# EAGLE design DMXDebugger (EAGLE 6.5.0)

## Sheet 1 of 2
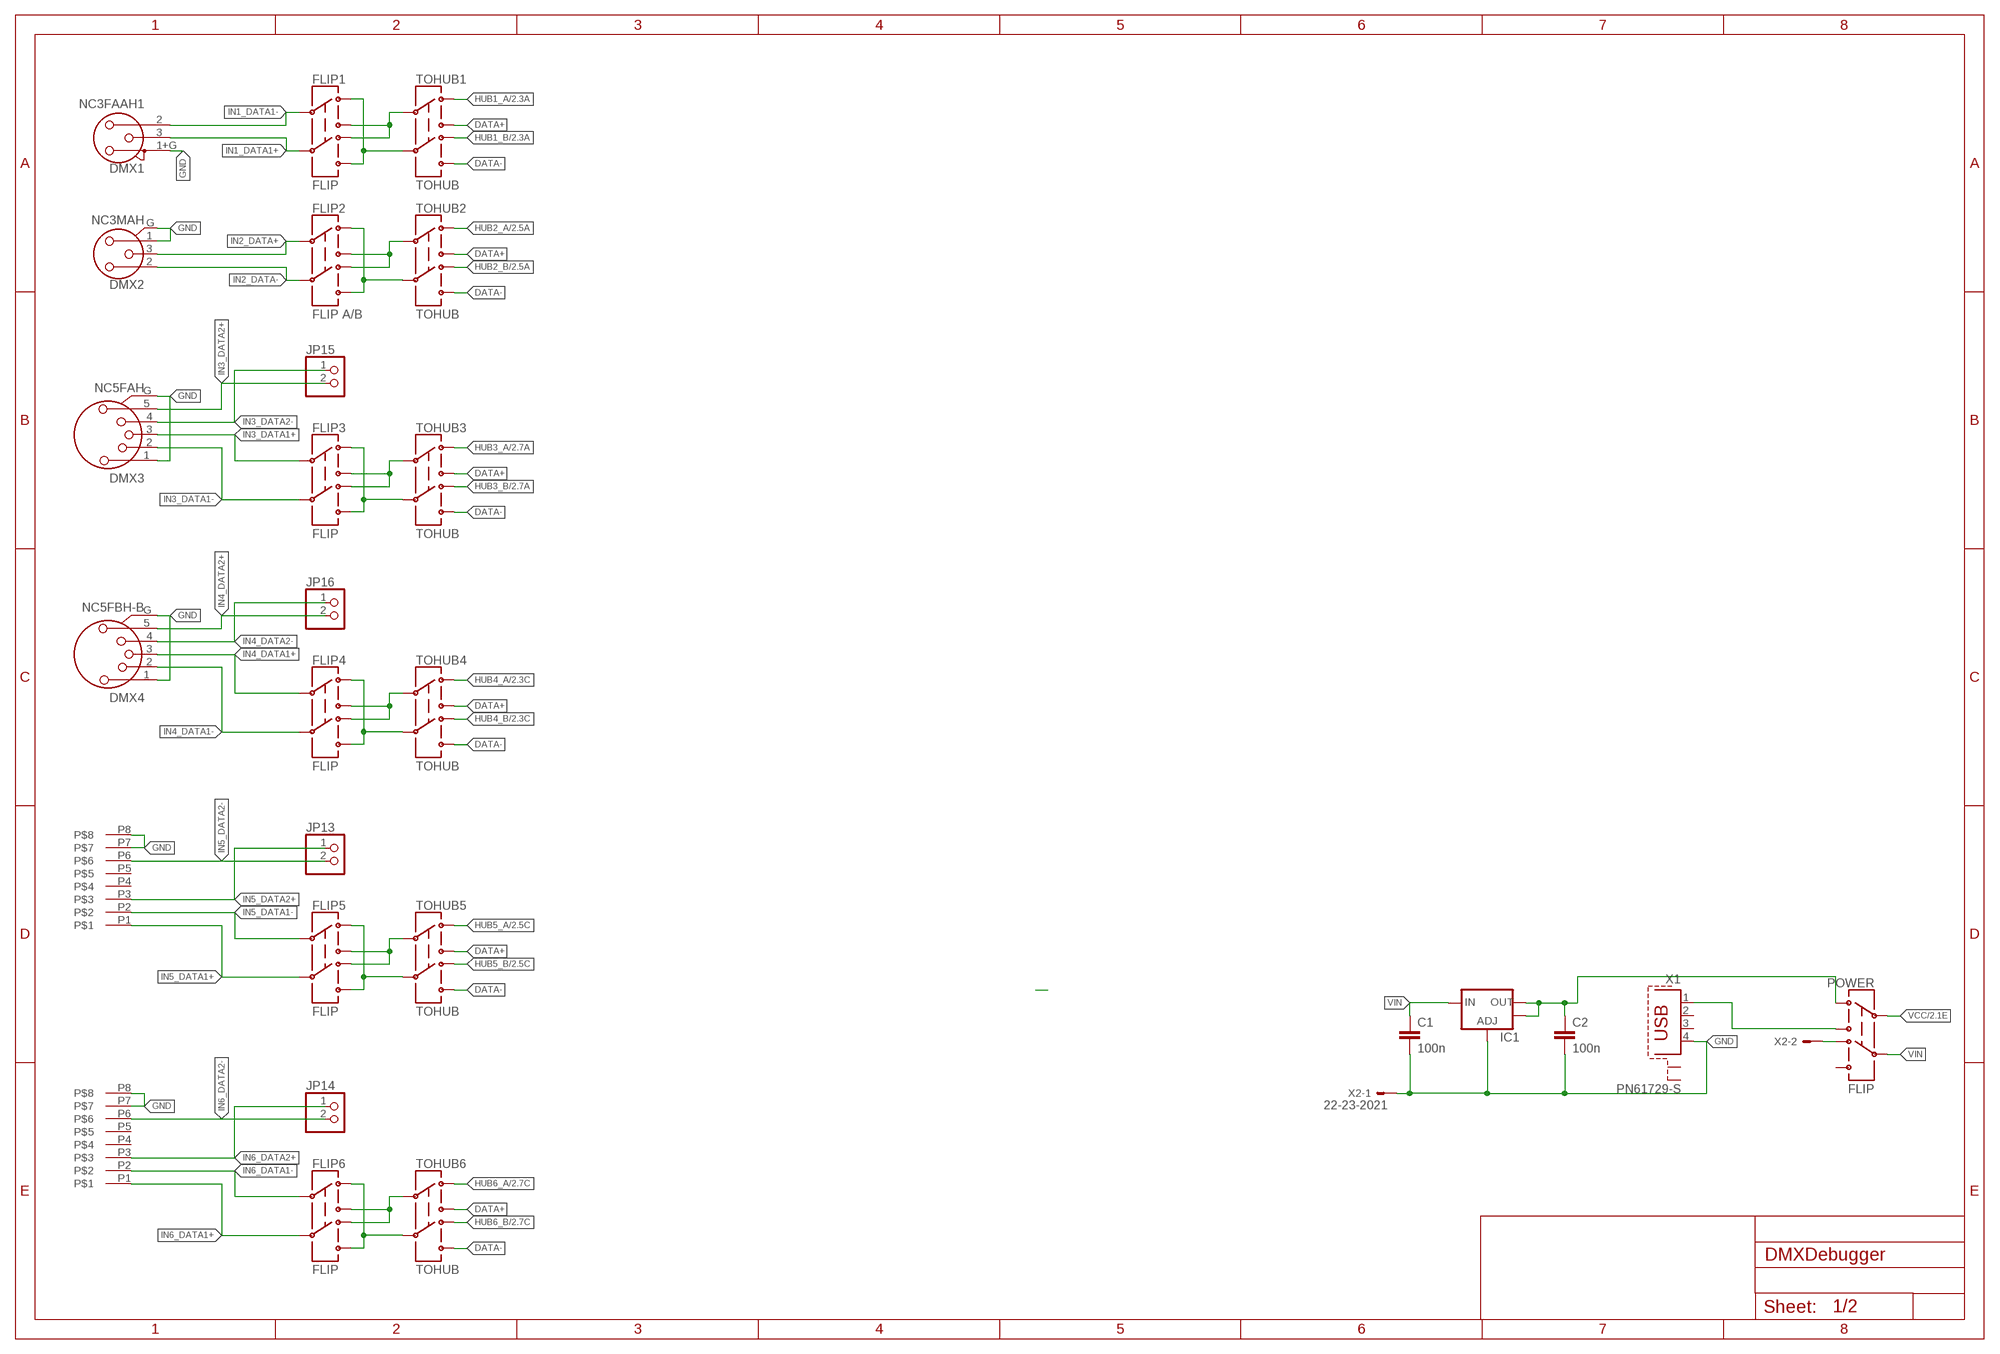
[diagram p0: schematic, sheet 1]

### Parts
C1  100n  C-EUC1206  [C1206]
C2  100n  C-EUC1206  [C1206]
DMX1  NC3FAAH1  MC3FAH1  [NC3FAH1]
DMX2  NC3MAH  NC3FAH2  [NC3FAH2]
DMX3  NC5FAH  [NC5FAH]
DMX4  NC5FBH-B  [NC5FBH-B]
DMX5  RJHS508  [P-RJHS-538X]
DMX6  RJHS508  [P-RJHS-538X]
FLIP1  FLIP  SWITCH-DPDT  [MSS-2235]
FLIP2  FLIP A/B  SWITCH-DPDT  [MSS-2235]
FLIP3  FLIP  SWITCH-DPDT  [MSS-2235]
FLIP4  FLIP  SWITCH-DPDT  [MSS-2235]
FLIP5  FLIP  SWITCH-DPDT  [MSS-2235]
FLIP6  FLIP  SWITCH-DPDT  [MSS-2235]
IC1  V_REG_LM1117SOT223  [SOT223]
JP13  PINHD-1X2  [1X02]
JP14  PINHD-1X2  [1X02]
JP15  PINHD-1X2  [1X02]
JP16  PINHD-1X2  [1X02]
POWER  FLIP  SWITCH-DPDT  [MSS-2235]
TOHUB1  TOHUB  SWITCH-DPDT  [MSS-2235]
TOHUB2  TOHUB  SWITCH-DPDT  [MSS-2235]
TOHUB3  TOHUB  SWITCH-DPDT  [MSS-2235]
TOHUB4  TOHUB  SWITCH-DPDT  [MSS-2235]
TOHUB5  TOHUB  SWITCH-DPDT  [MSS-2235]
TOHUB6  TOHUB  SWITCH-DPDT  [MSS-2235]
X1  PN61729-S  [PN61729-S]
X2  22-23-2021  [22-23-2021]

### Nets
DATA+: TOHUB1.3 TOHUB2.3 TOHUB3.3 TOHUB4.3 TOHUB5.3 TOHUB6.3
DATA-: TOHUB1.4 TOHUB2.4 TOHUB3.4 TOHUB4.4 TOHUB5.4 TOHUB6.4
GND: C1.2 C2.2 DMX1.1+G DMX2.1 DMX2.G DMX3.1 DMX3.G DMX4.1 DMX4.G DMX5.P7 DMX5.P8 DMX6.P7 DMX6.P8 IC1.1(ADJ) X1.4 X2.1 ; also sheet 2
HUB1_A: TOHUB1.1 ; also sheet 2
HUB1_B: TOHUB1.6 ; also sheet 2
HUB2_A: TOHUB2.1 ; also sheet 2
HUB2_B: TOHUB2.6 ; also sheet 2
HUB3_A: TOHUB3.1 ; also sheet 2
HUB3_B: TOHUB3.6 ; also sheet 2
HUB4_A: TOHUB4.1 ; also sheet 2
HUB4_B: TOHUB4.6 ; also sheet 2
HUB5_A: TOHUB5.1 ; also sheet 2
HUB5_B: TOHUB5.6 ; also sheet 2
HUB6_A: TOHUB6.1 ; also sheet 2
HUB6_B: TOHUB6.6 ; also sheet 2
IN1_DATA1+: DMX1.3 FLIP1.5
IN1_DATA1-: DMX1.2 FLIP1.2
IN2_DATA+: DMX2.3 FLIP2.2
IN2_DATA-: DMX2.2 FLIP2.5
IN3_DATA1+: DMX3.3 FLIP3.2
IN3_DATA1-: DMX3.2 FLIP3.5
IN3_DATA2+: DMX3.5 JP15.2
IN3_DATA2-: DMX3.4 JP15.1
IN4_DATA1+: DMX4.3 FLIP4.2
IN4_DATA1-: DMX4.2 FLIP4.5
IN4_DATA2+: DMX4.5 JP16.2
IN4_DATA2-: DMX4.4 JP16.1
IN5_DATA1+: DMX5.P1 FLIP5.5
IN5_DATA1-: DMX5.P2 FLIP5.2
IN5_DATA2+: DMX5.P3 JP13.1
IN5_DATA2-: DMX5.P6 JP13.2
IN6_DATA1+: DMX6.P1 FLIP6.5
IN6_DATA1-: DMX6.P2 FLIP6.2
IN6_DATA2+: DMX6.P3 JP14.1
IN6_DATA2-: DMX6.P6 JP14.2
N$1: POWER.6 X2.2
N$5: POWER.3 X1.1
N$77: FLIP1.3 FLIP1.6 TOHUB1.2
N$78: FLIP1.1 FLIP1.4 TOHUB1.5
N$79: FLIP2.1 FLIP2.4 TOHUB2.5
N$80: FLIP2.3 FLIP2.6 TOHUB2.2
N$81: FLIP3.1 FLIP3.4 TOHUB3.5
N$82: FLIP4.1 FLIP4.4 TOHUB4.5
N$83: FLIP5.1 FLIP5.4 TOHUB5.5
N$84: FLIP3.3 FLIP3.6 TOHUB3.2
N$85: FLIP4.3 FLIP4.6 TOHUB4.2
N$86: FLIP5.3 FLIP5.6 TOHUB5.2
N$87: FLIP6.1 FLIP6.4 TOHUB6.5
N$88: FLIP6.3 FLIP6.6 TOHUB6.2
VCC [Vcc]: POWER.2 ; also sheet 2
VIN: C1.1 IC1.3(IN) POWER.5
VOUT: C2.1 IC1.2(OUT) IC1.4(OUT) POWER.1
Unconnected: DMX5.P4 DMX5.P5 DMX6.P4 DMX6.P5 POWER.4 X1.2 X1.3 X1.S1 X1.S2

## Sheet 2 of 2
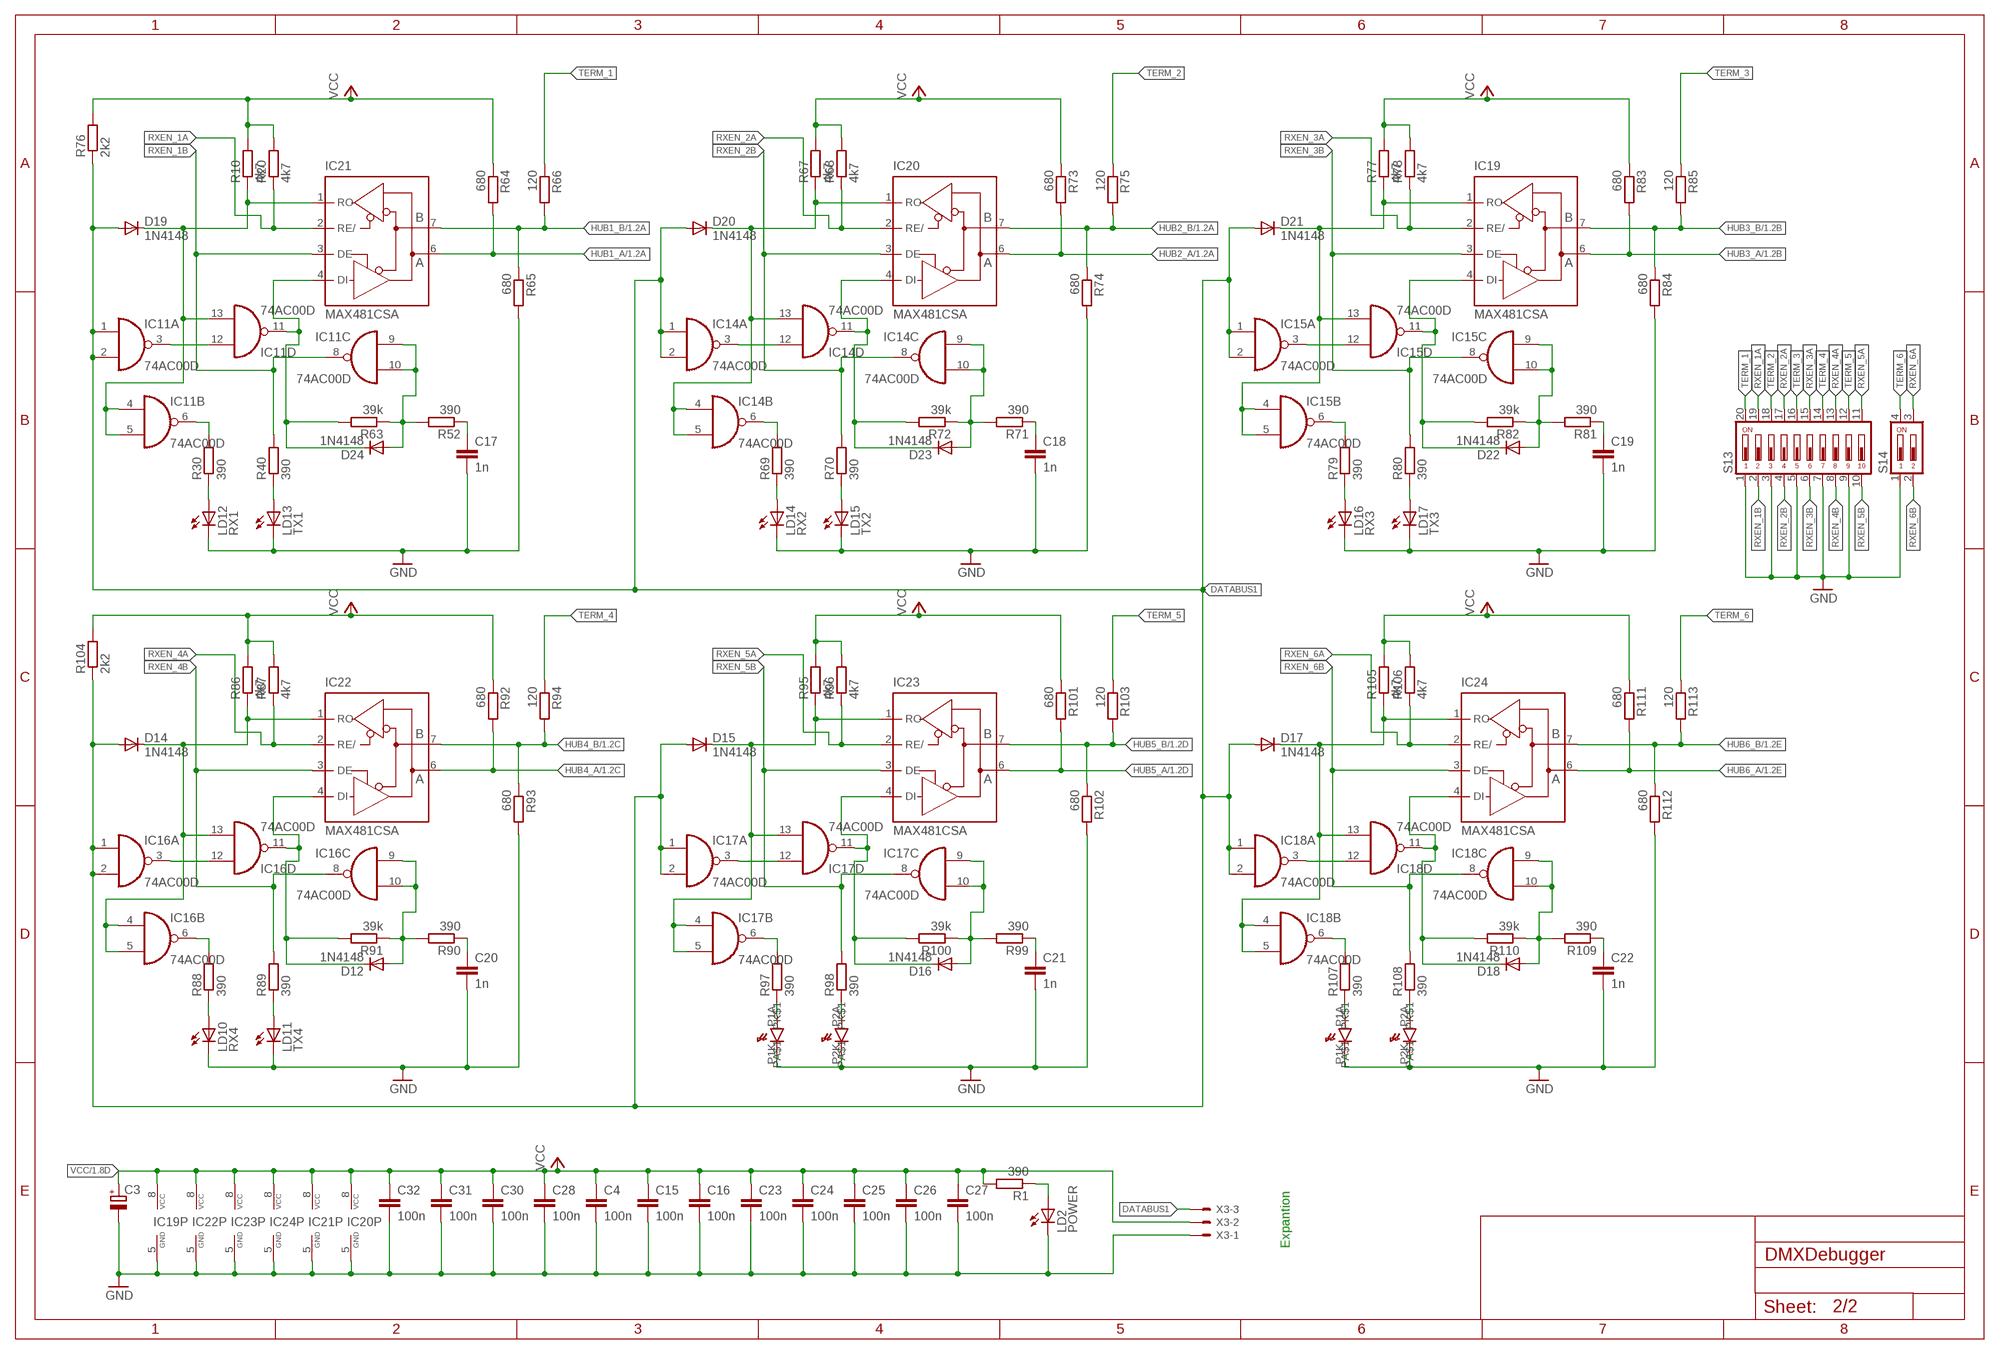
[diagram p1: schematic, sheet 2]

### Parts
C3  CPOL-EUD  [PANASONIC_D]
C4  100n  C-EUC1206  [C1206]
C15  100n  C-EUC1206  [C1206]
C16  100n  C-EUC1206  [C1206]
C17  1n  C-EUC1206  [C1206]
C18  1n  C-EUC1206  [C1206]
C19  1n  C-EUC1206  [C1206]
C20  1n  C-EUC1206  [C1206]
C21  1n  C-EUC1206  [C1206]
C22  1n  C-EUC1206  [C1206]
C23  100n  C-EUC1206  [C1206]
C24  100n  C-EUC1206  [C1206]
C25  100n  C-EUC1206  [C1206]
C26  100n  C-EUC1206  [C1206]
C27  100n  C-EUC1206  [C1206]
C28  100n  C-EUC1206  [C1206]
C30  100n  C-EUC1206  [C1206]
C31  100n  C-EUC1206  [C1206]
C32  100n  C-EUC1206  [C1206]
D12  1N4148  DIODE-MINIMELF  [MINIMELF]
D14  1N4148  DIODE-MINIMELF  [MINIMELF]
D15  1N4148  DIODE-MINIMELF  [MINIMELF]
D16  1N4148  DIODE-MINIMELF  [MINIMELF]
D17  1N4148  DIODE-MINIMELF  [MINIMELF]
D18  1N4148  DIODE-MINIMELF  [MINIMELF]
D19  1N4148  DIODE-MINIMELF  [MINIMELF]
D20  1N4148  DIODE-MINIMELF  [MINIMELF]
D21  1N4148  DIODE-MINIMELF  [MINIMELF]
D22  1N4148  DIODE-MINIMELF  [MINIMELF]
D23  1N4148  DIODE-MINIMELF  [MINIMELF]
D24  1N4148  DIODE-MINIMELF  [MINIMELF]
IC11  74AC00D  [SO14]
IC14  74AC00D  [SO14]
IC15  74AC00D  [SO14]
IC16  74AC00D  [SO14]
IC17  74AC00D  [SO14]
IC18  74AC00D  [SO14]
IC19  MAX481CSA  [SO08]
IC20  MAX481CSA  [SO08]
IC21  MAX481CSA  [SO08]
IC22  MAX481CSA  [SO08]
IC23  MAX481CSA  [SO08]
IC24  MAX481CSA  [SO08]
LD2  POWER  LEDCHIP-LED0603  [CHIP-LED0603]
LD10  RX4  LEDCHIP-LED0603  [CHIP-LED0603]
LD11  TX4  LEDCHIP-LED0603  [CHIP-LED0603]
LD12  RX1  LEDCHIP-LED0603  [CHIP-LED0603]
LD13  TX1  LEDCHIP-LED0603  [CHIP-LED0603]
LD14  RX2  LEDCHIP-LED0603  [CHIP-LED0603]
LD15  TX2  LEDCHIP-LED0603  [CHIP-LED0603]
LD16  RX3  LEDCHIP-LED0603  [CHIP-LED0603]
LD17  TX3  LEDCHIP-LED0603  [CHIP-LED0603]
R1  390  R-EU_R1206  [R1206]
R10  4k7  R-EU_R1206  [R1206]
R20  4k7  R-EU_R1206  [R1206]
R30  390  R-EU_R1206  [R1206]
R40  390  R-EU_R1206  [R1206]
R52  390  R-EU_R1206  [R1206]
R63  39k  R-EU_R1206  [R1206]
R64  680  R-EU_R1206  [R1206]
R65  680  R-EU_R1206  [R1206]
R66  120  R-EU_R1206  [R1206]
R67  4k7  R-EU_R1206  [R1206]
R68  4k7  R-EU_R1206  [R1206]
R69  390  R-EU_R1206  [R1206]
R70  390  R-EU_R1206  [R1206]
R71  390  R-EU_R1206  [R1206]
R72  39k  R-EU_R1206  [R1206]
R73  680  R-EU_R1206  [R1206]
R74  680  R-EU_R1206  [R1206]
R75  120  R-EU_R1206  [R1206]
R76  2k2  R-EU_R1206  [R1206]
R77  4k7  R-EU_R1206  [R1206]
R78  4k7  R-EU_R1206  [R1206]
R79  390  R-EU_R1206  [R1206]
R80  390  R-EU_R1206  [R1206]
R81  390  R-EU_R1206  [R1206]
R82  39k  R-EU_R1206  [R1206]
R83  680  R-EU_R1206  [R1206]
R84  680  R-EU_R1206  [R1206]
R85  120  R-EU_R1206  [R1206]
R86  4k7  R-EU_R1206  [R1206]
R87  4k7  R-EU_R1206  [R1206]
R88  390  R-EU_R1206  [R1206]
R89  390  R-EU_R1206  [R1206]
R90  390  R-EU_R1206  [R1206]
R91  39k  R-EU_R1206  [R1206]
R92  680  R-EU_R1206  [R1206]
R93  680  R-EU_R1206  [R1206]
R94  120  R-EU_R1206  [R1206]
R95  4k7  R-EU_R1206  [R1206]
R96  4k7  R-EU_R1206  [R1206]
R97  390  R-EU_R1206  [R1206]
R98  390  R-EU_R1206  [R1206]
R99  390  R-EU_R1206  [R1206]
R100  39k  R-EU_R1206  [R1206]
R101  680  R-EU_R1206  [R1206]
R102  680  R-EU_R1206  [R1206]
R103  120  R-EU_R1206  [R1206]
R104  2k2  R-EU_R1206  [R1206]
R105  4k7  R-EU_R1206  [R1206]
R106  4k7  R-EU_R1206  [R1206]
R107  390  R-EU_R1206  [R1206]
R108  390  R-EU_R1206  [R1206]
R109  390  R-EU_R1206  [R1206]
R110  39k  R-EU_R1206  [R1206]
R111  680  R-EU_R1206  [R1206]
R112  680  R-EU_R1206  [R1206]
R113  120  R-EU_R1206  [R1206]
S13  DIP10YL  [DIP10YL]
S14  DIP02YL  [DIP02YL]
X3  22-23-2031  [22-23-2031]

### Nets
DATABUS1: D14.A D15.A D17.A D19.A D20.A D21.A IC11.1(A:I0) IC11.2(A:I1) IC14.1(A:I0) IC14.2(A:I1) IC15.1(A:I0) IC15.2(A:I1) IC16.1(A:I0) IC16.2(A:I1) IC17.1(A:I0) IC17.2(A:I1) IC18.1(A:I0) IC18.2(A:I1) R76.1 R104.1 X3.3 ; also sheet 1
GND: C3.- C4.2 C15.2 C16.2 C17.2 C18.2 C19.2 C20.2 C21.2 C22.2 C23.2 C24.2 C25.2 C26.2 C27.2 C28.2 C30.2 C31.2 C32.2 DMX5.P1K(PK$1) DMX5.P2K(PK$1) DMX6.P1K(PK$1) DMX6.P2K(PK$1) IC19.5(GND) IC20.5(GND) IC21.5(GND) IC22.5(GND) IC23.5(GND) IC24.5(GND) LD2.C LD10.C LD11.C LD12.C LD13.C LD14.C LD15.C LD16.C LD17.C R65.2 R74.2 R84.2 R93.2 R102.2 R112.2 S13.1 S13.3 S13.5 S13.7 S13.9 S14.1 X3.1 ; also sheet 1
HUB1_A: IC21.6(A) R64.2 ; also sheet 1
HUB1_B: IC21.7(B) R65.1 R66.2 ; also sheet 1
HUB2_A: IC20.6(A) R73.2 ; also sheet 1
HUB2_B: IC20.7(B) R74.1 R75.2 ; also sheet 1
HUB3_A: IC19.6(A) R83.2 ; also sheet 1
HUB3_B: IC19.7(B) R84.1 R85.2 ; also sheet 1
HUB4_A: IC22.6(A) R92.2 ; also sheet 1
HUB4_B: IC22.7(B) R93.1 R94.2 ; also sheet 1
HUB5_A: IC23.6(A) R101.2 ; also sheet 1
HUB5_B: IC23.7(B) R102.1 R103.2 ; also sheet 1
HUB6_A: IC24.6(A) R111.2 ; also sheet 1
HUB6_B: IC24.7(B) R112.1 R113.2 ; also sheet 1
N$2: LD2.A R1.1
N$3: LD13.A R40.1
N$4: LD12.A R30.1
N$18: D19.C IC11.4(B:I0) IC11.5(B:I1) IC11.13(D:I1) IC21.1(RO) R10.1
N$20: IC11.3(A:O) IC11.12(D:I0)
N$30: IC11.6(B:O) R30.2
N$34: D24.A IC11.9(C:I0) IC11.10(C:I1) R52.2 R63.1
N$44: D24.C IC11.11(D:O) IC21.4(DI) R63.2
N$89: C17.1 R52.1
N$91: LD15.A R70.1
N$92: LD14.A R69.1
N$94: D20.C IC14.4(B:I0) IC14.5(B:I1) IC14.13(D:I1) IC20.1(RO) R67.1
N$95: IC14.3(A:O) IC14.12(D:I0)
N$96: IC14.6(B:O) R69.2
N$98: D23.A IC14.9(C:I0) IC14.10(C:I1) R71.2 R72.1
N$99: D23.C IC14.11(D:O) IC20.4(DI) R72.2
N$100: C18.1 R71.1
N$102: LD17.A R80.1
N$103: LD16.A R79.1
N$105: D21.C IC15.4(B:I0) IC15.5(B:I1) IC15.13(D:I1) IC19.1(RO) R77.1
N$106: IC15.3(A:O) IC15.12(D:I0)
N$107: IC15.6(B:O) R79.2
N$109: D22.A IC15.9(C:I0) IC15.10(C:I1) R81.2 R82.1
N$110: D22.C IC15.11(D:O) IC19.4(DI) R82.2
N$111: C19.1 R81.1
N$113: LD11.A R89.1
N$114: LD10.A R88.1
N$116: D14.C IC16.4(B:I0) IC16.5(B:I1) IC16.13(D:I1) IC22.1(RO) R86.1
N$117: IC16.3(A:O) IC16.12(D:I0)
N$118: IC16.6(B:O) R88.2
N$120: D12.A IC16.9(C:I0) IC16.10(C:I1) R90.2 R91.1
N$121: D12.C IC16.11(D:O) IC22.4(DI) R91.2
N$122: C20.1 R90.1
N$124: DMX5.P2A(PA$1) R98.1
N$125: DMX5.P1A(PA$1) R97.1
N$127: D15.C IC17.4(B:I0) IC17.5(B:I1) IC17.13(D:I1) IC23.1(RO) R95.1
N$128: IC17.3(A:O) IC17.12(D:I0)
N$129: IC17.6(B:O) R97.2
N$131: D16.A IC17.9(C:I0) IC17.10(C:I1) R99.2 R100.1
N$132: D16.C IC17.11(D:O) IC23.4(DI) R100.2
N$133: C21.1 R99.1
N$135: DMX6.P2A(PA$1) R108.1
N$136: DMX6.P1A(PA$1) R107.1
N$138: D17.C IC18.4(B:I0) IC18.5(B:I1) IC18.13(D:I1) IC24.1(RO) R105.1
N$139: IC18.3(A:O) IC18.12(D:I0)
N$140: IC18.6(B:O) R107.2
N$142: D18.A IC18.9(C:I0) IC18.10(C:I1) R109.2 R110.1
N$143: D18.C IC18.11(D:O) IC24.4(DI) R110.2
N$144: C22.1 R109.1
RXEN_1A: IC21.2(RE/) R20.1 S13.19
RXEN_1B: IC11.8(C:O) IC21.3(DE) R40.2 S13.2
RXEN_2A: IC20.2(RE/) R68.1 S13.17
RXEN_2B: IC14.8(C:O) IC20.3(DE) R70.2 S13.4
RXEN_3A: IC19.2(RE/) R78.1 S13.15
RXEN_3B: IC15.8(C:O) IC19.3(DE) R80.2 S13.6
RXEN_4A: IC22.2(RE/) R87.1 S13.13
RXEN_4B: IC16.8(C:O) IC22.3(DE) R89.2 S13.8
RXEN_5A: IC23.2(RE/) R96.1 S13.11
RXEN_5B: IC17.8(C:O) IC23.3(DE) R98.2 S13.10
RXEN_6A: IC24.2(RE/) R106.1 S14.3
RXEN_6B: IC18.8(C:O) IC24.3(DE) R108.2 S14.2
TERM_1: R66.1 S13.20
TERM_2: R75.1 S13.18
TERM_3: R85.1 S13.16
TERM_4: R94.1 S13.14
TERM_5: R103.1 S13.12
TERM_6: R113.1 S14.4
VCC [Vcc]: C3.+ C4.1 C15.1 C16.1 C23.1 C24.1 C25.1 C26.1 C27.1 C28.1 C30.1 C31.1 C32.1 IC19.8(VCC) IC20.8(VCC) IC21.8(VCC) IC22.8(VCC) IC23.8(VCC) IC24.8(VCC) R1.2 R10.2 R20.2 R64.1 R67.2 R68.2 R73.1 R76.2 R77.2 R78.2 R83.1 R86.2 R87.2 R92.1 R95.2 R96.2 R101.1 R104.2 R105.2 R106.2 R111.1 X3.2 ; also sheet 1

### Notes on the sheet
- Expantion

## Power pins joined to a net without a drawn wire
GND: IC11.7(P:GND) IC14.7(P:GND) IC15.7(P:GND) IC16.7(P:GND) IC17.7(P:GND) IC18.7(P:GND)
VCC: IC11.14(P:VCC) IC14.14(P:VCC) IC15.14(P:VCC) IC16.14(P:VCC) IC17.14(P:VCC) IC18.14(P:VCC)

## Library data of the parts
C1 C2 C4 C15-C28 C30-C32 = rcl:C-EU: CAPACITOR, European symbol
C3 = rcl:CPOL-EU: POLARIZED CAPACITOR, European symbol
D12 D14-D24 = diode:DIODE-: DIODE
DMX1 = con-neutrik_ag:MC3?: Neutrik Audio Connector XLR SERIES Stereo 1/4" jack Source: www.neutrik.com/; OC_FARNELL: 1310019; OC_NEWARK: unknown
DMX2 = con-neutrik_ag:NC3: Neutrik Audio Connector XLR SERIES Stereo 1/4" jack Source: www.neutrik.com/; MPN: NC3FAH2; OC_FARNELL: 724543; OC_NEWARK: 27B4208
DMX3 = con-neutrik_ag:NC5: Neutrik Audio Connector XLR SERIES Stereo 1/4" jack Source: www.neutrik.com/; MF: FARNELL; MPN: NC5FAH; OC_FARNELL: 8020418; OC_NEWARK: 38K6010
DMX4 = con-neutrik_ag:NC5: Neutrik Audio Connector XLR SERIES Stereo 1/4" jack Source: www.neutrik.com/; OC_FARNELL: unknown; OC_NEWARK: unknown
DMX5 DMX6 = RJHS:RJHS508
FLIP1-FLIP6 POWER TOHUB1-TOHUB6 = TME_slide_switch_MSS-2235:SWITCH-DPDT: DPDT Version of the COM-00597
IC1 = SparkFun:V_REG_LM1117: Voltage Regulator LM1117 Standard adjustable voltage regulator but in SMD form. Spark Fun Electronics SKU : COM-00595
IC11 IC14-IC18 = 74xx-eu:74*00: Quad 2-input NAND gate
IC19-IC24 = maxim:MAX481CSA: RS485 TRANSEIVER; MF: MAXIM; MPN: MAX481CSA; OC_FARNELL: unknown; OC_NEWARK: 90C3817
JP13-JP16 = pinhead:PINHD-1X2: PIN HEADER
LD2 LD10-LD17 = led:LED: LED OSRAM: - CHIPLED LG R971, LG N971, LY N971, LG Q971, LY Q971, LO R971, LY R971 LH N974, LH R974 LS Q976, LO Q976, LY Q976 LO Q996 - Hyper CHIPLED LW Q18S LB Q993, LB Q99A, LB R99A - SideLED LS A670, LO A670, LY A670, LG A670, LP A670 LB A673, LV A673, LT A673, LW A673 LH A674 LY A675 LS A676, LA A676, LO A676, LY A676, LW A676 LS A679, LY A679, LG A679 - Hyper Micro SIDELED® LS Y876, LA Y876, LO Y876, LY Y876 LT Y87S - SmartLED LW L88C, LW L88S LB L89C, LB L89S, LG L890 LS L89K, LO L89K, LY L89K LS L896, LA L896, LO L896, LY L896 - TOPLED LS T670, LO T670, LY T670, LG T670, LP T670 LSG T670, LSP T670, LSY T670, LOP T670, LYG T670 LG T671, LOG T671, LSG T671 LB T673, LV T673, LT T673, LW T673 LH T674 LS T676, LA T676, LO T676, LY T676, LB T676, LH T676, LSB T676, LW T676 LB T67C, LV T67C, LT T67C, LS T67K, LO T67K, LY T67K, LW E67C LS E67B, LA E67B, LO E67B, LY E67B, LB E67C, LV E67C, LT E67C LW T67C LS T679, LY T679, LG T679 LS T770, LO T770, LY T770, LG T770, LP T770 LB T773, LV T773, LT T773, LW T773 LH T774 LS E675, LA E675, LY E675, LS T675 LS T776, LA T776, LO T776, LY T776, LB T776 LHGB T686 LT T68C, LB T68C - Hyper Mini TOPLED® LB M676 - Mini TOPLED Santana® LG M470 LS M47K, LO M47K, LY M47K Source: http://www.osram.convergy.de LUXEON: - LUMILED® LXK2-PW12-R00, LXK2-PW12-S00, LXK2-PW14-U00, LXK2-PW14-V00 LXK2-PM12-R00, LXK2-PM12-S00, LXK2-PM14-U00 LXK2-PE12-Q00, LXK2-PE12-R00, LXK2-PE12-S00, LXK2-PE14-T00, LXK2-PE14-U00 LXK2-PB12-K00, LXK2-PB12-L00, LXK2-PB12-M00, LXK2-PB14-N00, LXK2-PB14-P00, LXK2-PB14-Q00 LXK2-PR12-L00, LXK2-PR12-M00, LXK2-PR14-Q00, LXK2-PR14-R00 LXK2-PD12-Q00, LXK2-PD12-R00, LXK2-PD12-S00 LXK2-PH12-R00, LXK2-PH12-S00 LXK2-PL12-P00, LXK2-PL12-Q00, LXK2-PL12-R00 Source: www.luxeon.com KINGBRIGHT: KA-3528ASYC Source: www.kingbright.com
R1 R10 R20 R30 R40 R52 R63-R113 = rcl:R-EU_: RESISTOR, European symbol
S13 = switch-dil:DIP10YL: DIL/CODE SWITCH; OC_FARNELL: unknown; OC_NEWARK: unknown
S14 = switch-dil:DIP02YL: DIL/CODE SWITCH; OC_FARNELL: unknown; OC_NEWARK: unknown
X1 = con-berg:PN61729-S: BERG USB connector; OC_FARNELL: unknown; OC_NEWARK: unknown
X2 = con-molex:22-23-2021: .100" (2.54mm) Center Header - 2 Pin; MF: MOLEX; MPN: 22-23-2021; OC_FARNELL: 1462926; OC_NEWARK: 25C3832
X3 = con-molex:22-23-2031: .100" (2.54mm) Center Header - 3 Pin; MF: MOLEX; MPN: 22-23-2031; OC_FARNELL: 1462950; OC_NEWARK: 30C0862

## Net classes
0 default: width 0.254 mm, clearance 0.254 mm
1 Vcc: width 0.254 mm, clearance 0.15 mm
2 Gnd: width 0.254 mm, clearance 0.15 mm

## Board
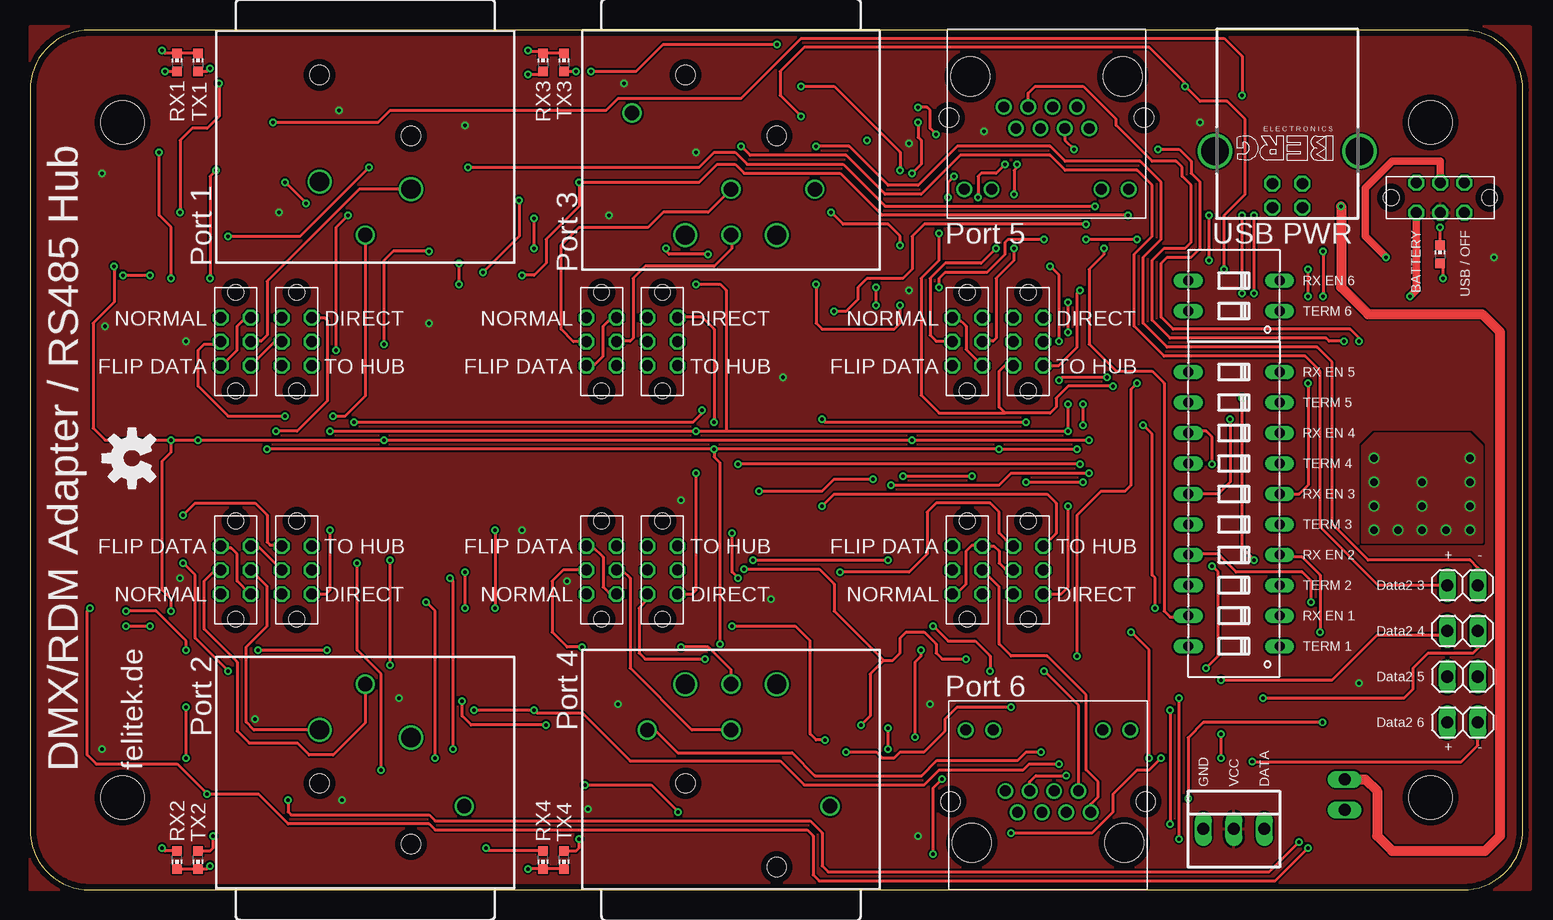
[diagram p2: board, top side]
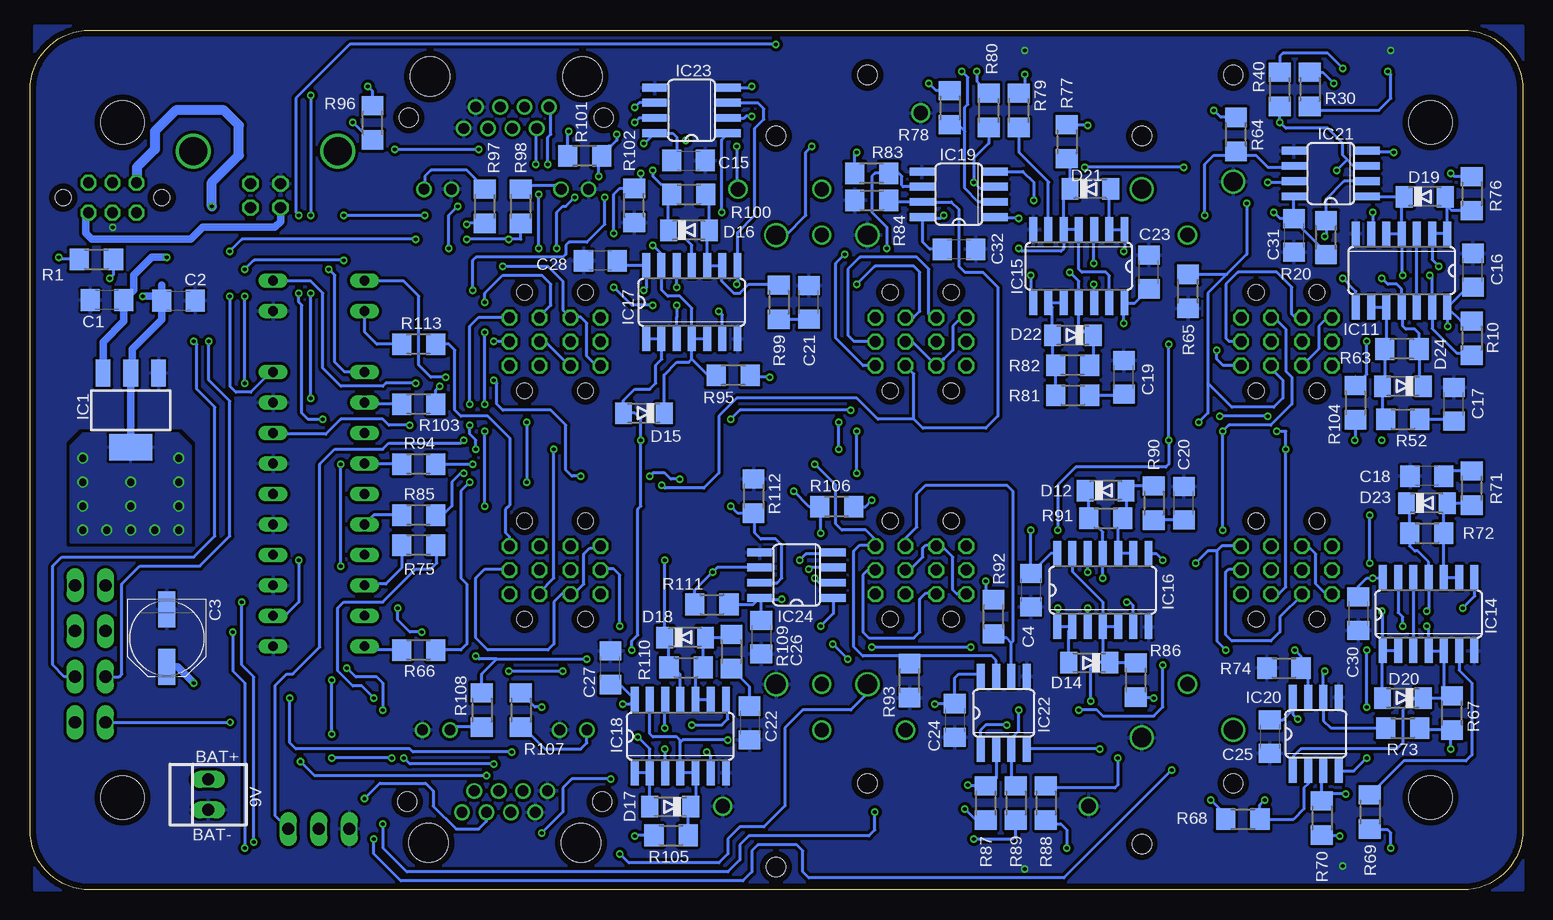
[diagram p3: board, bottom side, seen from below]

Size 124.4 x 71.7 mm. Coordinates in mm from the lower left corner, seen from the top.
Outline: 0,5 arc90 5,0 119.4,0 arc90 124.4,5 124.4,66.7 arc90 119.4,71.7 5,71.7 arc90 0,66.7 0,5
Copper layers (1*16): Top 0.035mm / dielectric 1.5mm / Bottom 0.035mm
Design rules "aetzwerk *": minimum track width 6mil, minimum drill 12mil, track to track 6mil, track to pad 6mil, pad to pad 6mil, via to via 6mil, smd to smd 6mil, copper to edge 20mil, drill to drill 8mil, minimum pad ring 8mil, minimum via ring 6mil, stop-mask expansion 3mil, vias tented up to drill 0mil, thermal gap 8mil
Holes 3.6 mm at 7.7,7.7 7.7,64 116.7,64 116.7,7.7
bKeepout: area 0,0 to 124.5,2.5; area 0,0 to 2.5,72.4; area 121.9,0 to 124.5,72.4; area 0,69.8 to 124.5,72.4; area 113.3,4.6 to 120,11.3; area 113.5,60.9 to 120.1,67.6; area 4.3,60.9 to 10.9,67.6; area 4.3,4.4 to 10.9,11.1

### Footprints (pad centres in the part's own frame; a part is rotated, then mirrored left to right if it is on the bottom)
C1206 = smd 1.6 x 1.8: 1 -1.4,0; 2 1.4,0
PANASONIC_D = smd 3 x 1.4: + 2.4,0; - -2.4,0
MINIMELF = smd 1.4 x 1.8: A 1.7,0; C -1.7,0
NC3FAH1 = drill 1.6: 1+G -3.81,0.635; 2 3.81,0 | drill 1.2: 3 0,-3.815 | hole 1.6: -3.81,9.525; 3.81,4.445
NC3FAH2 = drill 1.6: 1 -3.81,0.635; 2 3.81,0 | drill 1.2: 3 0,-3.815; G -8.25,6.355 | hole 1.6: -3.81,9.525; 3.81,4.445
NC5FAH = drill 1.6: 1 -3.81,-3.815; 5 3.81,-3.815 | drill 1.2: 2 0,0; 3 0,-3.815; 4 6.98,0; G -8.25,6.355 | hole 1.6: 3.81,4.445; -3.81,9.525
NC5FBH-B = drill 1.6: 1 -3.81,-3.815; 5 3.81,-3.815 | drill 1.2: 2 0,0; 3 0,-3.815; 4 6.98,0; G -8.25,6.355 | hole 1.6: 3.81,4.445; -3.81,11.43
P-RJHS-538X = drill 0.9: P1 7.112,-1.778; P1A -3.302,5.08; P1K -1.016,5.08; P2 6.096,0; P2A 8.128,5.08; P2K 10.414,5.08; P3 5.08,-1.778; P4 4.064,0; P5 3.048,-1.778; P6 2.032,0; P7 1.016,-1.778; P8 0,0 | hole 3.251: 9.906,-4.318; -2.794,-4.318 | hole 1.575: -4.572,-0.889; 11.684,-0.889
MSS-2235 = drill 0.9 octagon: 1 -2,-1.25; 2 0,-1.25; 3 2,-1.25; 4 2,1.25; 5 0,1.25; 6 -2,1.25 | hole 1.3: -4.1,0; 4.1,0
SOT223 = smd 1.219 x 2.235: 1 -2.311,-3.099; 2 0,-3.099; 3 2.311,-3.099 | smd 3.6 x 2.2: 4 0,3.099
SO14 = smd 0.66 x 2.032: 1 -3.81,-3.073; 2 -2.54,-3.073; 3 -1.27,-3.073; 4 0,-3.073; 5 1.27,-3.073; 6 2.54,-3.073; 7 3.81,-3.073; 8 3.81,3.073; 9 2.54,3.073; 10 1.27,3.073; 11 0,3.073; 12 -1.27,3.073; 13 -2.54,3.073; 14 -3.81,3.073
SO08 = smd 0.66 x 2.032: 1 -1.905,-3.073; 2 -0.635,-3.073; 3 0.635,-3.073; 4 1.905,-3.073; 5 1.905,3.073; 6 0.635,3.073; 7 -0.635,3.073; 8 -1.905,3.073
1X02 = drill 1.016 long: 1 -1.27,0; 2 1.27,0
CHIP-LED0603 = smd 0.8 x 0.8: A 0,-0.75; C 0,0.75
R1206 = smd 1.6 x 1.803: 1 -1.422,0; 2 1.422,0
DIP10YL = drill 0.813 long: 1 -11.43,-3.81; 2 -8.89,-3.81; 3 -6.35,-3.81; 4 -3.81,-3.81; 5 -1.27,-3.81; 6 1.27,-3.81; 7 3.81,-3.81; 8 6.35,-3.81; 9 8.89,-3.81; 10 11.43,-3.81; 11 11.43,3.81; 12 8.89,3.81; 13 6.35,3.81; 14 3.81,3.81; 15 1.27,3.81; 16 -1.27,3.81; 17 -3.81,3.81; 18 -6.35,3.81; 19 -8.89,3.81; 20 -11.43,3.81
DIP02YL = drill 0.813 long: 1 -1.27,-3.81; 2 1.27,-3.81; 3 1.27,3.81; 4 -1.27,3.81
PN61729-S = drill 0.95 octagon: 1 1.25,4.71; 2 -1.25,4.71; 3 -1.25,2.71; 4 1.25,2.71 | drill 2.3 pad 2.9: S1 -6.02,0; S2 6.02,0
22-23-2021 = drill 1 long: 1 -1.27,0; 2 1.27,0
22-23-2031 = drill 1 long: 1 -2.54,0; 2 0,0; 3 2.54,0

### Placement (x,y rotation side)
C1  117.99,49.18 180 bottom
C2  112.03,49.14 0 bottom
C3  113,21 270 bottom
C4  41,25 270 bottom
C15  69.53,60.82 0 bottom
C16  4.16,51.67 90 bottom
C17  5.75,40.5 90 bottom
C18  8,34.5 180 bottom
C19  33.25,42.75 90 bottom
C20  28.25,32.25 90 bottom
C21  59.5,49 90 bottom
C22  64.43,13.92 270 bottom
C23  31.16,51.52 90 bottom
C24  47.34,14.13 270 bottom
C25  21.09,12.78 270 bottom
C26  63.46,21.08 270 bottom
C27  76.04,18.52 90 bottom
C28  76.87,52.46 180 bottom
C30  13.71,23.03 270 bottom
C31  19.08,54.58 270 bottom
C32  46.98,53.42 0 bottom
D12  34.76,33.3 0 bottom
D14  36.13,18.95 180 bottom
D15  73.25,39.75 180 bottom
D16  69.5,55 0 bottom
D17  71.05,6.95 180 bottom
D18  69.81,21.05 0 bottom
D19  8.17,57.8 0 bottom
D20  10,16 180 bottom
D21  36.03,58.45 0 bottom
D22  37.5,46.25 180 bottom
D23  8,32.25 0 bottom
D24  10,42 180 bottom
DMX1  27.94,58.42 0 top
DMX2  27.94,13.34 180 top
DMX3  58.42,58.42 0 top
DMX4  58.42,13.34 180 top
DMX5  88.27,63.5 180 top
DMX6  81.28,8.26 0 top
FLIP1  17.14,45.72 90 top
FLIP2  17.14,26.67 270 top
FLIP3  47.62,45.72 90 top
FLIP4  47.62,26.67 270 top
FLIP5  78.11,45.72 90 top
FLIP6  78.11,26.67 270 top
IC1  116,40 180 bottom
IC11  10.1,51.63 180 bottom
IC14  7.84,23 0 bottom
IC15  37,52 180 bottom
IC16  35,25 0 bottom
IC17  69.25,49 0 bottom
IC18  70.21,12.82 0 bottom
IC19  47,58 90 bottom
IC20  17.25,13 0 bottom
IC21  16,59.73 90 bottom
IC22  43.25,14.75 0 bottom
IC23  69.27,65 90 bottom
IC24  60.52,26.25 90 bottom
JP13  119.38,17.78 0 top
JP14  119.38,13.97 0 top
JP15  119.38,25.4 180 top
JP16  119.38,21.59 180 top
LD2  117.5,53 0 top
LD10  42.75,2.5 180 top
LD11  44.5,2.5 180 top
LD12  12.25,69 0 top
LD13  14,69 0 top
LD14  12.25,2.5 180 top
LD15  14,2.5 180 top
LD16  42.75,69 0 top
LD17  44.5,69 0 top
POWER  117.53,57.72 0 top
R1  118.87,52.58 180 bottom
R10  4.25,46 90 bottom
R20  16.4,54.39 270 bottom
R30  17.75,66.75 90 bottom
R40  20.25,66.75 270 bottom
R52  10,39.25 180 bottom
R63  10.07,45.1 0 bottom
R64  23.9,62.99 270 bottom
R65  27.9,49.91 270 bottom
R66  92,20 0 bottom
R67  5.9,14.75 270 bottom
R68  23.33,5.9 180 bottom
R69  12.75,6.5 90 bottom
R70  16.75,6 90 bottom
R71  4.25,33.5 270 bottom
R72  8,29.75 180 bottom
R73  10,13.5 180 bottom
R74  19.9,18.5 180 bottom
R75  92,28.75 0 bottom
R76  4.25,58.06 90 bottom
R77  38,62.39 90 bottom
R78  47.75,65.22 90 bottom
R79  42,65 270 bottom
R80  44.5,65 270 bottom
R81  37.5,41.25 180 bottom
R82  37.5,43.75 0 bottom
R83  54.25,59.75 0 bottom
R84  54.25,57.5 180 bottom
R85  92,31.25 0 bottom
R86  32.25,17.5 270 bottom
R87  44.75,7.25 270 bottom
R88  39.75,7.25 90 bottom
R89  42.25,7.25 90 bottom
R90  30.75,32.25 90 bottom
R91  34.75,31 180 bottom
R92  44.1,22.78 270 bottom
R93  51.1,17.45 270 bottom
R94  92,35.5 0 bottom
R95  65.79,42.9 0 bottom
R96  95.85,63.96 270 bottom
R97  86.5,57 270 bottom
R98  83.5,57 270 bottom
R99  62,49 90 bottom
R100  69.5,58 180 bottom
R101  78.17,61.2 0 bottom
R102  74.05,57.07 270 bottom
R103  92,40.5 0 bottom
R104  13.95,40.63 90 bottom
R105  70.98,4.55 180 bottom
R106  57.17,31.95 0 bottom
R107  83.5,15 90 bottom
R108  86.75,15 90 bottom
R109  65.95,19.88 90 bottom
R110  69.73,18.55 180 bottom
R111  67.58,23.8 180 bottom
R112  64.1,32.83 90 bottom
R113  92,45.5 0 bottom
S13  100.33,31.75 90 top
S14  100.33,49.53 90 top
TOHUB1  22.23,45.72 90 top
TOHUB2  22.23,26.67 270 top
TOHUB3  52.7,45.72 90 top
TOHUB4  52.7,26.67 270 top
TOHUB5  83.19,45.72 90 top
TOHUB6  83.19,26.67 270 top
U$1  [OSHW-LOGO-M]  8.5,36 90 top
X1  104.78,61.59 180 top
X2  109.55,7.94 90 bottom
X3  100.33,5.08 0 top

### Tracks (layer width: path | path; a pad name or v marks a point on that pad's centre or on a via)
DATA+  (via drill 0.3)
  Top 0.254: v20.5,38.25 22.25,38.25 24.75,40.75 24.75,47.5 24.53,47.72 TOHUB1.3 | v87.25,36.75 v80.75,36.75 v57,36.75 | v57,39 57,46.75 56,47.75 53.98,47.75 TOHUB3.3 | TOHUB4.3 51.45,24.2 50.75,23.5 50.75,19.75 51.25,19.25 v56.25,19.25 | v57.5,20.5 57.5,35.61 57,36.11 v57,36.75 | v87.75,38.75 v87.75,40.5 | v57,36.75 v19.75,36.75
  Bottom 0.254: TOHUB2.3 20.33,24.67 19.75,25.25 v19.75,36.75 19.75,38.25 v20.5,38.25 | v56.25,19.25 v57.5,20.5 | TOHUB6.3 81.94,24.82 80.75,26 v80.75,36.75 | v87.25,36.75 87.25,37.5 87.75,38 v87.75,38.75 | v87.75,40.5 87.75,47 87,47.75 84.47,47.75 TOHUB5.3 | v57,36.75 v57,39
DATA-  (via drill 0.3)
  Top 0.254: TOHUB2.4 24.67,24.67 25,25 v25,30 | v25,38.25 v55.5,38.25 58,38.25 | 58,38.25 v86.5,38.25 v86.5,40.5 | v55.5,50.5 57.5,50.5 58,50 58,38.25 | TOHUB4.4 55.17,24.67 55.5,25 v55.5,34.75 | TOHUB6.4 85.92,24.67 86.5,25.25 v86.5,32 | v86.5,46.5 v86.5,49
  Bottom 0.254: v25,30 v25,38.25 24.5,38.75 21,38.75 19.25,40.5 19.25,42.75 19.75,43.25 19.75,46.75 20.72,47.72 TOHUB1.4 | TOHUB3.4 50.78,47.72 50.25,48.25 50.25,51.5 50.75,52 54,52 v55.5,50.5 | v55.5,34.75 v55.5,38.25 | v86.5,32 v86.5,38.25 | v86.5,40.5 v86.5,46.5 | v86.5,49 86.5,49.75 85,51.25 81.75,51.25 81,50.5 81,48.75 81.94,47.81 TOHUB5.4
DATABUS1  (via drill 0.3)
  Top 0.254: v7,52 7,49 5.25,47.25 5.25,38.5 6.25,37.5 v11.75,37.5 | v11.75,37.5 v14,37.5 v29.5,37.5 v73.5,37.5 v88.25,37.5 | v11.75,23.25 11.75,24.25 11,25 11,35.75 11.75,36.5 v11.75,37.5 | v33.25,53.25 30.25,53.25 29.5,52.5 v29.5,45.5 | v38.75,30 v38.75,23.5 | v73.75,12.75 73.75,19 74.25,19.5 v74.25,20
  Bottom 0.254: D20.A 11.7,19.88 IC14.1 | IC14.2 IC14.1 | v7,52 7.55,52.55 IC11.2 IC11.1 6.29,57 | IC14.1 11.65,23.16 v11.75,23.25 | R104.1 13.95,37.55 v14,37.5 | D14.A 37.83,21.64 IC16.2 IC16.1 38.75,21.99 v38.75,23.5 | D21.A 34.46,58.32 IC15.2 IC15.1 33.19,53.31 v33.25,53.25 | v29.5,45.5 v29.5,37.5 29.5,35.5 29.75,35.25 37.25,35.25 38.75,33.75 v38.75,30 | IC18.2 IC18.1 | D17.A IC18.2 | IC18.2 72.75,11.75 v73.75,12.75 | v74.25,20 74.25,20.75 73.75,21.25 73.75,31.75 73.5,32 v73.5,37.5 73.5,39.25 74,39.75 D15.A 74.95,40.8 74,41.75 72.75,41.75 72.25,42.25 72.25,43.75 71.75,44.25 71.75,45.89 IC17.2 IC17.1 | 6.29,57 6.29,57.62 D19.A | R76.1 5.92,56.64 6.29,57 | v88.25,37.5 88.5,37.25 94.5,37.25 95,36.75 99,36.75 100.25,35.5 100.25,20.25 102.5,18 103,18 104,17 104,6.21 X3.3
GND  (via drill 0.3)
  Top 0.254: LD11.C LD10.C 42.71,1.79 41.54,1.79 v41.5,1.75 | LD13.C LD12.C 11.25,69.75 v11,70 11.09,69.91 | LD17.C LD16.C 42.59,69.91 41.59,69.91 v41.5,70 | LD14.C LD15.C 14.75,1.75 v15,2 | LD2.C v117.5,55.25
  pour Bottom (rank 3): 0,72 124,72 124,0 0,0
HUB1_A  (via drill 0.3)
  Top 0.254: v25.5,45 25.5,55.25 v26.5,56.25
  Bottom 0.254: v26.5,56.25 26.5,60.5 25.75,61.25 24,61.25 | 24,61.25 22.25,61.25 21.25,60.25 19.19,60.25 IC21.6 | R64.2 23.9,61.35 24,61.25 | TOHUB1.1 23.5,43.75 25,43.75 25.5,44.25 v25.5,45
HUB1_B  (via drill 0.3)
  Top 0.254: v27,39 55.25,39 56,39.75 v56,40 | v66,39.25 66.25,39 v83,39 | v83,34 v87.75,34 | v23,57.25 v21.25,59
  Bottom 0.254: v21.25,59 19.17,59 IC21.7 | v23,57.25 23,53 24.67,51.33 | 24.67,51.33 26.25,49.75 26.25,42.25 | 26.25,42.25 24.25,40.25 20.75,40.25 20,41 20,42.5 20.98,43.48 TOHUB1.6 | R65.1 24.67,51.33 | 26.25,42.25 26.25,39.75 v27,39 | v56,40 65.25,40 v66,39.25 | v83,39 v83,34 | v87.75,34 88.5,33.25 88.5,26 88,25.5 88,20.5 88.5,20 R66.2
HUB2_A  (via drill 0.3)
  Top 0.254: v16.5,18.25 13.75,21 13.75,26.25 v12.75,27.25 | v12.75,31.25 13.75,32.25 18.75,32.25 19.75,31.25 19.75,29 20,28.75 20.89,28.75 TOHUB2.1
  Bottom 0.254: R73.2 16,13.5 16.61,14.12 IC20.6 16.61,18.14 v16.5,18.25 | v12.75,27.25 v12.75,31.25
HUB2_B  (via drill 0.3)
  Top 0.254: v95.75,4.25 v95.75,16 | v29.25,10 29.25,18 27.25,20 v27.25,27.25 | v19,20 v24.75,20
  Bottom 0.254: IC20.7 17.89,17.91 R74.1 18.5,18.52 18.5,19.5 v19,20 | TOHUB2.6 25.08,28.67 25.5,28.25 | 25.5,28.25 25.5,20.75 v24.75,20 | 25.5,28.25 26.25,28.25 v27.25,27.25 | v29.25,10 38.25,1 59.5,1 60,1.5 60,3.25 60.5,3.75 63.75,3.75 64.25,3.25 64.25,1.5 65,0.75 93.5,0.75 95.75,3 v95.75,4.25 | R75.2 90.5,28.67 90.5,27.25 91,26.75 92.25,26.75 95,24 98.25,24 98.75,23.5 98.75,18.25 97.5,17 96.75,17 v95.75,16
HUB3_A  (via drill 0.3)
  Top 0.254: v53,53.5 53,53.25 53.25,53 v56.5,53
  Bottom 0.254: IC19.6 51.63,58.63 51.75,58.75 51.75,59.5 52,59.75 R83.2 54,59.75 54.25,59.5 54.25,56.5 53,55.25 v53,53.5 | TOHUB3.1 54.97,43.72 57.25,46 57.25,52.25 v56.5,53
HUB3_B  (via drill 0.3)
  Top 0.254: v71.75,33.75 80.75,33.75 81.75,34.75 v88.25,34.75
  Bottom 0.254: 50.75,39.25 50,38.5 44.75,38.5 43.75,39.5 43.75,50.25 45,51.5 46.5,51.5 47,52 47,56.75 47.62,57.37 IC19.7 52.94,57.37 52.83,57.48 R84.1 | 50.75,39.25 50.75,43.02 TOHUB3.6 | 50.75,39.25 53.75,39.25 55.5,41 65.5,41 67,39.5 67,34.75 68.25,33.5 71.5,33.5 v71.75,33.75 | v88.25,34.75 88.5,34.75 89.25,34 89.25,32 90,31.25 R85.2
HUB4_A
  Bottom 0.254: IC22.6 42.62,20.61 | 42.62,20.61 43,21 43.74,21 R92.2 | TOHUB4.1 51.45,29.3 50.5,30.25 50.5,33 49.75,33.75 43,33.75 42.5,33.25 42.5,20.73 42.62,20.61
HUB4_B  (via drill 0.3)
  Top 0.254: v87.5,35.5 v59,35.5
  Bottom 0.254: IC22.7 43.88,19.14 44.25,19.5 51,19.5 | 51,19.5 55,19.5 55.75,20.25 55.75,28.25 55.25,28.75 54.03,28.75 | 54.03,28.75 TOHUB4.6 | R93.1 51.1,19.4 51,19.5 | 54.03,28.75 54.03,29.29 54.75,30 56.75,30 57.25,30.5 57.25,33.75 v59,35.5 | R94.2 v87.5,35.5
HUB5_A  (via drill 0.3)
  Top 0.254: TOHUB5.1 85.72,43.72 87.25,45.25 87.25,49.75 v87.5,50 | v75.5,63 75,63.5 75,65 74.75,65.25 v74,65.25 | v76.5,57.75 76.5,59 v77,59.5
  Bottom 0.254: v87.5,50 87.5,52.5 87.25,52.75 80,52.75 79.75,53 79.75,53.75 79.5,54 78,54 76.5,55.5 v76.5,57.75 | IC23.6 73.61,65.64 v74,65.25 | v75.5,63 75.5,62.5 76,62 76.2,62 76.2,61.75 R101.2 77,61.2 v77,59.5
HUB5_B  (via drill 0.3)
  Top 0.254: v90.25,42 86.5,42 85.5,41 85.5,40.25 85,39.75 81.25,39.75 | 81.25,39.75 80.75,40.25 80.75,43.25 81.25,43.75 81.91,43.75 TOHUB5.6 | 81.25,39.75 75.75,39.75 74.25,41.25 74.25,51 75.75,52.5 v75.75,54.75 | v74,64 74,62.75 74.25,62.5 74.25,60.5 v73.5,59.75
  Bottom 0.254: R103.2 90.58,41.67 v90.25,42 | IC23.7 73.64,64.36 v74,64 | 74,58.54 R102.1 | v73.5,59.75 73.5,59.04 R102.1 | v75.75,54.75 75.75,58 75.25,58.5 R102.1
HUB6_A  (via drill 0.3)
  Top 0.254: TOHUB6.1 81.83,28.67 80.75,29.75 80.75,31.5 80,32.25 75.5,32.25 74.75,31.5 74.75,28 73.25,26.5 v67.5,26.5
  Bottom 0.254: IC24.6 67.11,26.89 v67.5,26.5 69,25 R111.2
HUB6_B  (via drill 0.3)
  Top 0.254: v66,32 67,33 84.75,33 85.5,32.25 85.5,29.73 TOHUB6.6
  Bottom 0.254: TOHUB6.6 84.44,29.43 84.75,29.75 84.75,31.75 84.44,32.06 84.44,37.69 86.25,39.5 88.5,39.5 89,40 89,45 89.5,45.5 R113.2 | IC24.7 62.13,25.61 61.75,26 61.75,28.75 62.25,29.25 63.5,29.25 64,29.75 64,31.31 R112.1 65.41,31.41 v66,32
IN1_DATA1+  (via drill 0.3)
  Top 0.254: DMX1.3 27.94,41.19 26.25,39.5 v25.25,39.5 | FLIP1.5 15.68,45.5 14.5,45.5 14,45 14,42 16.5,39.5 v21.25,39.5
  Bottom 0.254: v21.25,39.5 v25.25,39.5
IN1_DATA1-
  Top 0.254: DMX1.2 27.42,58.42 19.75,50.75 19.75,46.25 19.25,45.75 18.43,45.75 FLIP1.2
IN2_DATA+
  Top 0.254: DMX2.3 27.94,13.94 25.25,11.25 23.25,11.25 22.25,12.25 18.25,12.25 17.25,13.25 17.25,19 14.5,21.75 14.5,25.75 15.42,26.67 FLIP2.2
IN2_DATA-
  Top 0.254: FLIP2.5 19.75,25.32 19.75,22 18,20.25 18,14 18.66,13.34 DMX2.2
IN3_DATA1+
  Top 0.254: FLIP3.2 48.91,45.75 50,45.75 50.25,46 50.25,51 51.25,52 57,52 58.5,53.5 58.5,54.52 DMX3.3
IN3_DATA1-
  Top 0.254: FLIP3.5 45.28,45.72 44.25,46.75 44.25,53.75 45.75,55.25 51.5,55.25 52.75,56.5 56.5,56.5 DMX3.2
IN3_DATA2+  (via drill 0.3)
  Top 0.254: JP15.2 112.35,25.4 107.5,30.25 107.5,43.25 106.25,44.5 94.5,44.5 92,47 92,53 93.5,54.5 93.5,58.75 92.25,60 86.25,60 85,61.25 77.5,61.25 74.25,58 71.25,58 68,61.25 60,61.25 v59.25,62
  Bottom 0.254: DMX3.5 61.4,54.6 59.75,56.25 59.75,61.5 v59.25,62
IN3_DATA2-  (via drill 0.3)
  Top 0.254: JP15.1 120.65,26.85 120,27.5 111.5,27.5 108.5,30.5 108.5,44 107.25,45.25 94.75,45.25 92.75,47.25 92.75,52.75 94.25,54.25 94.25,59 92.5,60.75 86.25,60.75 85,62 77.25,62 74,58.75 71.5,58.75 68.25,62 v65.5,62
  Bottom 0.254: v65.5,62 65.5,58.52 DMX3.4
IN4_DATA1+  (via drill 0.3)
  Top 0.254: FLIP4.2 44.42,26.67 43.5,25.75 43.5,21.5 44.75,20.25 v46,20.25 | DMX4.3 58.42,18.33 56.5,20.25 v54.25,20.25
  Bottom 0.254: v54.25,20.25 v46,20.25
IN4_DATA1-
  Top 0.254: DMX4.2 55.16,13.34 50,18.5 50,26 49.33,26.67 FLIP4.5
IN4_DATA2+  (via drill 0.3)
  Top 0.254: v81.75,4.75 88.5,4.75 90.25,6.5 90.25,8 92.25,10 93.25,10 v94.25,11 | v99.25,11 v99.25,13 | v99.25,17.5 108.5,17.5 112.25,21.25 117.77,21.25 JP16.2 | v75.25,3 75.25,8.5 v76,9.25
  Bottom 0.254: DMX4.5 54.61,16.39 56,15 60,15 61.5,13.5 61.5,7 63.25,5.25 65.25,5.25 66.25,4.25 66.25,3 67,2.25 74.5,2.25 v75.25,3 | v76,9.25 79.25,9.25 80,8.5 80,6.5 v81.75,4.75 | v94.25,11 v99.25,11 | v99.25,13 v99.25,17.5
IN4_DATA2-  (via drill 0.3)
  Top 0.254: DMX4.4 52.07,13.34 53.98,11.43 63.5,11.43 65.41,9.53 74.3,9.53 75.56,10.79 82.3,10.79 83,11.5 v84.25,11.5 | v102.75,16 114.5,16 115.25,16.75 115.25,18.5 116.5,19.75 120.25,19.75 120.75,20.25 120.65,20.35 JP16.1
  Bottom 0.254: v84.25,11.5 92.5,11.5 92.75,11.75 102.25,11.75 102.75,12.25 v102.75,16
IN5_DATA1+  (via drill 0.3)
  Top 0.254: FLIP5.5 76.83,45.75 75.5,45.75 75,46.25 75,51 76.25,52.25 79.25,52.25 v80.5,53.5 | v81.25,60.5 80.5,59.75 79.25,59.75 79,59.5 v79,57.75
  Bottom 0.254: v80.5,53.5 80.5,56.5 80,57 79.75,57 v79,57.75 | v81.25,60.5 81.25,62.75 81,63 81,65.12 DMX5.P1
IN5_DATA1-  (via drill 0.3)
  Top 0.254: FLIP5.2 79.39,45.75 80.25,45.75 80.5,46 80.5,51 82,52.5 v82,53.5 | v82.25,60.5 82.25,60.25 82,60 v82,58
  Bottom 0.254: v82,53.5 v82,58 | v82.25,60.5 82.25,63.42 DMX5.P2
IN5_DATA2+  (via drill 0.3)
  Top 0.254: DMX5.P3 83.19,66.44 83.75,67 87.75,67 90.5,64.25 90.5,63.75 93.5,60.75 95.5,60.75 96,60.25 96,59.5 96.75,58.75 96.75,54 96.25,53.5 94.5,53.5 93.5,52.5 93.5,47.5 95,46 108,46 108.25,45.75 v109.5,45.75
  Bottom 0.254: JP13.1 116.97,17.78 116.75,18 116.75,25.5 115.25,27 110.25,27 107.75,29.5 107.75,40.75 109.5,42.5 v109.5,45.75
IN5_DATA2-  (via drill 0.3)
  Top 0.254: DMX5.P6 86.23,62.52 v87,61.75 | v110.75,45.75 110.75,46 110,46.75 95.25,46.75 94.25,47.75 94.25,52.25 94.75,52.75 96.75,52.75 97.5,53.5 97.5,59 96.75,59.75 96.75,60.75 95.75,61.75 v94,61.75
  Bottom 0.254: JP13.2 121.53,17.78 122.5,18.75 122.5,27 121.75,27.75 110.75,27.75 109,29.5 109,40.25 110.5,41.75 110.5,45.5 v110.75,45.75 | v94,61.75 v87,61.75
IN6_DATA1+
  Top 0.254: DMX6.P1 88.39,7.14 89,7.75 89,9 88,10 88,16.25 84.75,19.5 81.75,19.5 80.75,20.5 80.75,25.27 FLIP6.5
IN6_DATA1-  (via drill 0.3)
  Top 0.254: DMX6.P2 87.38,15.37 v84.5,18.25 | v80,18.25 80,19.5 78.75,20.75 76.5,20.75 v75.25,22
  Bottom 0.254: v84.5,18.25 v80,18.25 | v75.25,22 75.25,26.25 75.75,26.75 76.78,26.75 FLIP6.2
IN6_DATA2+  (via drill 0.3)
  Top 0.254: v107.72,13.97 97.79,13.97 96.52,12.7 v96.52,7.62
  Bottom 0.254: JP14.1 v107.72,13.97 | v96.52,7.62 95.25,8.89 91.44,8.89 90.81,8.26 90.81,6.99 88.9,5.08 87,5.08 86.36,5.71 DMX6.P3
IN6_DATA2-  (via drill 0.3)
  Top 0.254: DMX6.P6 83.31,9.02 83.82,9.53 v86.36,9.53 | JP14.2 120.65,12.06 119.28,10.7 v101.85,10.7
  Bottom 0.254: v86.36,9.53 100.67,9.53 v101.85,10.7
N$1  (via drill 0.3)
  Top 0.813: X2.2 111.29,9.21 112.25,8.25 112.25,4.5 113.5,3.25 121.25,3.25 122.5,4.5 122.5,46.5 121,48 111.5,48 109.25,50.25 v109.25,57
  Bottom 0.813: v109.25,57 109.25,59 107,61.25 107,63.75 108.25,65 112.25,65 114,63.25 114,61.75 115.5,60.25 115.5,58.99 POWER.6
N$2  (via drill 0.3)
  Top 0.254: v117.75,51 117.75,52 LD2.A
  Bottom 0.254: R1.1 117.45,51.3 v117.75,51
N$3  (via drill 0.3)
  Top 0.254: 14.91,68.41 v15,68.5 14.75,68.25 LD13.A
  Bottom 0.254: v15,68.5 16.25,69.75 20,69.75 20.25,69.5 R40.1
N$4  (via drill 0.3)
  Top 0.254: v11.25,68.25 LD12.A
  Bottom 0.254: R30.1 17.42,65 12,65 11,66 11,68 v11.25,68.25
N$5
  Bottom 0.61: X1.1 103.53,55.73 104,55.25 110,55.25 111,54.25 119.25,54.25 119.75,54.75 119.75,56.24 POWER.3
N$6  (via drill 0.3)
  other vias: 69.75,62.5
N$18  (via drill 0.3)
  Top 0.254: v7.75,51.25 v10,51.25
  Bottom 0.254: IC11.5 IC11.4 | v10,51.25 10.1,51.34 IC11.4 | IC11.4 10.1,57.58 D19.C 9.87,57.83 IC21.1 | R10.1 4.42,44.75 5.5,44.75 7.55,46.8 IC11.13 7.55,51.05 v7.75,51.25
N$20
  Bottom 0.254: IC11.12 IC11.3
N$30  (via drill 0.3)
  Top 0.254: v12.5,56.5 12.5,62.5 13.5,63.5 14.75,63.5 15.75,64.5 v15.75,67.25
  Bottom 0.254: R30.2 16.67,68.17 v15.75,67.25 | v12.5,56.5 12.5,54.84 IC11.6
N$34
  Bottom 0.254: IC11.9 IC11.10 11.37,45.23 R63.1 11.49,42.21 D24.A 11.7,39.53 R52.2
N$44  (via drill 0.3)
  Top 0.254: v11.75,51 11.75,55.25 10.75,56.25 v10.75,61.5
  Bottom 0.254: D24.C 8.65,42.35 R63.2 8.65,46.4 9,46.75 9.75,46.75 10,47 10,48.47 IC11.11 10.1,50.09 10.5,50.5 11.25,50.5 v11.75,51 | v10.75,61.5 12.79,61.5 IC21.4
N$77
  Top 0.254: FLIP1.6 15.97,43.72 17.25,45 17.25,47 17.75,47.5 18.18,47.5 FLIP1.3
  Bottom 0.254: FLIP1.3 18.97,47.72 19.25,48 19.25,50.25 20.5,51.5 23.75,51.5 24.75,50.5 24.75,46 24.5,45.75 23.5,45.75 TOHUB1.2
N$78
  Top 0.254: TOHUB1.5 20.39,45.72 FLIP1.1
  Bottom 0.254: FLIP1.4 16.28,47.72 17,47 17,45.12 FLIP1.1 18.47,43.72
N$79
  Top 0.254: FLIP2.4 18.33,24.67 17.25,25.75 17.25,28 16.75,28.5 16.07,28.5 FLIP2.1
  Bottom 0.254: FLIP2.4 18.39,24.61 20.25,22.75 20.25,21.5 21,20.75 24.25,20.75 24.75,21.25 24.75,26.5 24.5,26.75 23.55,26.75 TOHUB2.5
N$80
  Top 0.254: FLIP2.6 18.98,28.67 TOHUB2.2
  Bottom 0.254: FLIP2.3 16.42,24.67 17.25,25.5 17.25,28 17.75,28.5 18.23,28.5 FLIP2.6
N$81
  Bottom 0.254: FLIP3.4 46.78,47.72 47.5,47 47.5,45 48.25,44.25 48.34,44.25 FLIP3.1 50.88,45.72 TOHUB3.5
N$82
  Top 0.254: FLIP4.1 46.83,28.67 47.75,27.75 47.75,25.25 48.25,24.75 48.8,24.75 FLIP4.4
  Bottom 0.254: TOHUB4.5 54.58,26.67 55,26.25 55,21.5 54.5,21 50.75,21 50.25,21.5 50.25,24.25 49.75,24.75 48.95,24.75 FLIP4.4
N$83
  Top 0.254: FLIP5.4 77.28,47.72 78,47 78,45.08 FLIP5.1
  Bottom 0.254: FLIP5.1 79.47,43.72 81.5,45.75 81.91,45.75 TOHUB5.5
N$84
  Top 0.254: FLIP3.6 46.97,43.72 47.75,44.5 47.75,47 48.25,47.5 48.66,47.5 FLIP3.3
  Bottom 0.254: FLIP3.3 49.22,47.72 49.5,48 49.5,51.75 50.5,52.75 55.25,52.75 56.25,51.75 56.25,46.25 55.75,45.75 53.98,45.75 TOHUB3.2
N$85
  Bottom 0.254: FLIP4.3 47.17,24.67 47.5,25 47.5,27.75 48.25,28.5 48.7,28.5 FLIP4.6 48.95,28.75 49.75,28.75 50,28.5 50,27.75 51.08,26.67 TOHUB4.2
N$86  (via drill 0.3)
  Top 0.254: v85.75,45.75 85.75,51.25 v85,52
  Bottom 0.254: FLIP5.6 77.22,43.72 78,44.5 78,47.25 78.5,47.75 79.33,47.75 FLIP5.3 80,48.37 80,50.75 81.25,52 v85,52 | TOHUB5.2 85.72,45.72 v85.75,45.75
N$87
  Bottom 0.254: FLIP6.1 77.03,28.5 77.75,28.5 78.25,28 78.25,25.5 79.08,24.67 FLIP6.4 80.08,24.67 80.75,24 80.75,20.5 81.25,20 86.25,20 87.25,21 87.25,26 86.5,26.75 84.52,26.75 TOHUB6.5
N$88
  Top 0.254: FLIP6.3 77.17,24.67 78,25.5 78,28.25 78.5,28.75 79.28,28.75 FLIP6.6 80.33,28.67 80.75,28.25 80.75,27.25 81.25,26.75 81.86,26.75 TOHUB6.2
N$89
  Bottom 0.254: R52.1 5.9,39.25 C17.1
N$91  (via drill 0.3)
  Top 0.254: LD15.A 15,3.25 15.25,3.5 v15.25,4.5
  Bottom 0.254: v15.25,4.5 16.67,4.5 R70.1
N$92  (via drill 0.3)
  Top 0.254: 11.21,3.29 v11,3.5 11.25,3.25 LD14.A
  Bottom 0.254: v11,3.5 11,4.75 11.25,5 12.67,5 R69.1
N$94  (via drill 0.3)
  Top 0.254: v8,22 v10,22
  Bottom 0.254: IC20.1 19.16,11.1 18.5,11.75 10.5,11.75 10,12.25 10,15 9,16 D20.C 6.07,16 R67.1 6.58,16.85 IC14.5 IC14.4 7.84,21.84 v8,22 | v10,22 10,22.75 10.38,23.14 IC14.13
N$95
  Bottom 0.254: IC14.12 IC14.3
N$96
  Bottom 0.254: IC14.6 5.3,18.3 4.25,17.25 4.25,11.25 4.75,10.75 9.92,10.75 R69.2
N$98
  Bottom 0.254: IC14.9 IC14.10 R72.1 6.58,31.97 D23.A 4.42,32.25 R71.2
N$99  (via drill 0.3)
  Top 0.254: v13,11 v13,15.25 | v13,20 13,20.75 10.5,23.25 v8,23.25
  Bottom 0.254: IC20.4 14.07,9.93 v13,11 | D23.C 9.42,31.97 R72.2 9.42,28.67 9,28.25 8.75,28.25 7.84,27.34 IC14.11 7.84,23.41 v8,23.25 | v13,15.25 v13,20
N$100
  Bottom 0.254: R71.1 6.18,34.92 C18.1
N$102  (via drill 0.3)
  Top 0.254: LD17.A v45.5,68.25
  Bottom 0.254: v45.5,68.25 45.5,67.42 R80.1
N$103  (via drill 0.3)
  Top 0.254: v41.5,68 42.5,68 LD16.A
  Bottom 0.254: v41.5,68 41.5,66.92 R79.1
N$105  (via drill 0.3)
  Top 0.254: v42,53.5 v42,56
  Bottom 0.254: R77.1 37.73,60.7 D21.C 38.27,57.91 IC15.5 | IC15.5 IC15.4 37,51.75 36.75,51.5 34.75,51.5 34.46,51.21 IC15.13 | IC15.5 38.27,53.48 38.5,53.25 41.75,53.25 v42,53.5 | v42,56 43.83,56 IC19.1
N$106  (via drill 0.3)
  Top 0.254: v35.75,50.5 v35.75,52.25
  Bottom 0.254: IC15.12 35.73,50.48 v35.75,50.5 | v35.75,52.25 35.75,55.05 IC15.3
N$107
  Bottom 0.254: R79.2 42,61.5 39.75,59.25 39.54,59.04 | 39.54,59.04 39.5,59 | IC15.6 39.54,59.04
N$109
  Bottom 0.254: IC15.10 IC15.9 39.2,48.59 D22.A 39.2,44.03 R82.1 R81.2
N$110  (via drill 0.3)
  Top 0.254: v40.75,57.5 40.75,54.5 v37.75,51.5
  Bottom 0.254: R82.2 35.8,44.03 D22.C 36.25,46.25 37,47 IC15.11 37,50.75 v37.75,51.5 | IC19.4 41.66,59.91 40.75,59 v40.75,57.5
N$111
  Bottom 0.254: R81.1 33.35,41.25 C19.1
N$113  (via drill 0.3)
  Top 0.254: LD11.A 45.5,3.25 45.75,3.5 v45.75,4.25
  Bottom 0.254: v45.75,4.25 42.5,4.25 42.25,4.5 R89.1
N$114  (via drill 0.3)
  Top 0.254: LD10.A 42.71,3.29 38.21,3.29 v38,3.5
  Bottom 0.254: R88.1 39.42,5.5 38.5,5.5 38,5 v38,3.5
N$116  (via drill 0.3)
  Top 0.254: v43,13.75 36.75,13.75 36,14.5 v36,15.75
  Bottom 0.254: R86.1 34.4,18.92 D14.C | IC16.5 IC16.4 | IC16.13 37.54,26.54 35,24 IC16.4 | IC16.4 35,19.52 D14.C | IC22.1 45.16,13.35 44.75,13.75 v43,13.75 | v36,15.75 36,18.5 35.5,19 34.48,19 D14.C
N$117  (via drill 0.3)
  Top 0.254: v36.25,23.5 v36.25,26.5
  Bottom 0.254: IC16.3 36.27,23.48 v36.25,23.5 | v36.25,26.5 36.25,28.05 IC16.12
N$118  (via drill 0.3)
  Top 0.254: v33.75,11 33.75,23.25 v33,24
  Bottom 0.254: v33,24 32.75,24 32.5,23.75 32.5,21.97 IC16.6 | v33.75,11 33.75,8.75 34,8.5 39.67,8.5 39.67,8.59 R88.2
N$120
  Bottom 0.254: IC16.9 IC16.10 33.73,30.6 R91.1 33.06,31.27 D12.A 32.69,33.67 R90.2
N$121  (via drill 0.3)
  Top 0.254: v35.25,11.75 35.25,25.75 v35,26
  Bottom 0.254: D12.C 36.17,33.01 R91.2 35,29.83 IC16.11 v35,26 | v35.25,11.75 41.27,11.75 IC22.4
N$122
  Bottom 0.254: C20.1 30.73,30.85 R90.1
N$124
  Bottom 0.254: R98.1 82.83,58.42 82.5,58.75 80.47,58.75 DMX5.P2A
N$125
  Bottom 0.254: R97.1 86.5,58.5 88,60 91,60 91.5,59.5 91.5,58.49 DMX5.P1A
N$127  (via drill 0.3)
  Top 0.254: v72.5,53.75 72.5,54.5 71.5,55.5 67.75,55.5 v66.75,56.5
  Bottom 0.254: IC17.5 IC17.4 | IC17.4 69.25,48.5 70.25,49.5 71.25,49.5 71.75,50 71.75,52.03 IC17.13 71.79,53.04 v72.5,53.75 | D15.C 71.55,42.95 70.5,44 69.5,44 69.25,44.25 | 69.25,44.25 IC17.4 | R95.1 67.9,42.9 69.25,44.25 | 66.29,63 IC23.1 66.75,62.54 v66.75,56.5
N$128  (via drill 0.3)
  Top 0.254: v70.5,48.75 v70.5,50.25
  Bottom 0.254: IC17.3 70.52,47.73 70.5,47.75 v70.5,48.75 | v70.5,50.25 70.5,52.05 IC17.12
N$129  (via drill 0.3)
  Top 0.254: v67,48.25 68,48.25 69,49.25 69,50.25 69.75,51 72.75,51 73.5,51.75 73.5,54.5 74.5,55.5 v88,55.5
  Bottom 0.254: IC17.6 66.71,47.96 v67,48.25 | R97.2 87.92,55.58 v88,55.5
N$131
  Bottom 0.254: R100.1 67.8,57.72 D16.A 67.98,54.82 IC17.10 IC17.9 66.75,52.03 66.75,50.75 65.75,49.75 65.25,49.75 64.5,50.5 62.08,50.5 R99.2
N$132  (via drill 0.3)
  Top 0.254: v64.25,67 67,67 72.5,61.5 v72.5,60
  Bottom 0.254: IC17.11 69.25,53.75 69.75,54.25 70.45,54.25 D16.C 71.2,57.72 R100.2 71.75,58.83 71.83,58.83 72.5,59.5 v72.5,60 | IC23.4 64.34,66.91 v64.25,67
N$133
  Bottom 0.254: R99.1 59.52,47.58 C21.1
N$135
  Bottom 0.254: R108.1 89.17,13.58 DMX6.P2A
N$136
  Bottom 0.254: R107.1 83.33,13.58 81.5,11.75 78.5,11.75 78,12.25 78,13.31 DMX6.P1A
N$138  (via drill 0.3)
  Top 0.254: v58.5,22 63.75,22 65,20.75 65,13 65.5,12.5 v66.25,12.5
  Bottom 0.254: IC24.1 57.45,23.05 v58.5,22 | 70.25,12.25 70.25,12.5 70.5,12.75 72.5,12.75 72.75,13 IC18.13 | 70.25,12.25 70.25,9.79 IC18.4 IC18.5 68.94,7.36 D17.C 69.56,6.74 R105.1 | v66.25,12.5 70,12.5 70.25,12.25
N$139  (via drill 0.3)
  Top 0.254: v71.5,11.75 v71.5,13.5
  Bottom 0.254: IC18.3 71.48,11.73 v71.5,11.75 | v71.5,13.5 71.5,15.87 IC18.12
N$140  (via drill 0.3)
  Top 0.254: v68,11.5 70.5,11.5 71,11 72,11 72.5,11.5 74.5,11.5 76.25,13.25 76.25,14.25 77.25,15.25 v81.75,15.25
  Bottom 0.254: IC18.6 67.67,11.17 v68,11.5 | 83.42,16.5 R107.2 | 83.33,16.25 R107.2 | v81.75,15.25 82.33,15.25 R107.2
N$142
  Bottom 0.254: IC18.9 IC18.10 68.94,17.92 R110.1 68.31,20.85 D18.A 66.2,21.05 R109.2
N$143  (via drill 0.3)
  Top 0.254: v60.25,27.5 v71.5,27.5
  Bottom 0.254: IC18.11 70.25,15.93 70.25,18 70.8,18.55 R110.2 71.15,20.69 D18.C v71.51,27.49 v71.5,27.5 | IC24.4 57.6,28 59.75,28 v60.25,27.5
N$144
  Bottom 0.254: C22.1 64.43,16.94 R109.1
RXEN_1A  (via drill 0.3)
  Top 0.254: v16.5,54.5 22.5,54.5 v28.25,60.25 | v88.75,57 71.25,57 67.75,60.5 59.75,60.5 58.75,61.5 57,61.5 55.75,60.25 v36.5,60.25 | S13.19 96.41,22.75 95,22.75 94.5,23.25 94.5,42.25 93.5,43.25 90.5,43.25 88.25,45.5 88.25,51.75 89.5,53 v89.5,53.5
  Bottom 0.254: IC21.2 14.9,59.09 16.4,57.6 R20.1 16.4,54.6 v16.5,54.5 | v89.5,53.5 89.5,56.25 v88.75,57 | v28.25,60.25 v36.5,60.25
RXEN_1B  (via drill 0.3)
  Top 0.254: v15.5,60 15,59.5 v15,51 | v20.25,64 29,64 30,65 48,65 49,66 59.25,66 64.25,71 99.5,71 101,69.5 v101,66.25 | v102,27.5 101,28.5 v101,41 | v101,49.75 v101,56.25
  Bottom 0.254: IC21.3 14.12,60.37 14.62,60.88 | 14.62,60.88 15,61.25 15,62.25 16.25,63.5 19.75,63.5 v20.25,64 R40.2 | IC11.8 13.9,49.91 v15,51 | v15.5,60 14.62,60.88 | v102,27.5 102,24 103,23 104,23 S13.2 | v101,66.25 v101,56.25 | v101,41 v101,49.75
RXEN_2A  (via drill 0.3)
  Top 0.254: v21.5,7.5 21.5,6.5 21.75,6.25 33.25,6.25 33.75,5.75 65,5.75 66,4.75 66,2 66.5,1.5 103.25,1.5 v105.75,4 | v106.75,23.98 106.75,25.75 106,26.5 100.5,26.5 99,28 96.58,28 S13.17
  Bottom 0.254: IC20.2 17.89,8.87 18.25,8.5 18.25,6.75 19.1,5.9 R68.1 21.91,7.09 v21.5,7.5 | v105.75,4 105.75,17.75 106,18 106.75,18.75 v106.75,23.98
RXEN_2B  (via drill 0.3)
  Top 0.254: v106.5,3.5 103.75,0.75 65.75,0.75 65.25,1.25 65.25,4.5 64.75,5 33.75,5 33.25,5.5 21.5,5.5 19,8 v14.75,8 12.25,10.5 5.5,10.5 4.75,11.25 4.75,23.25 v5,23.5 | S13.4 104.33,27.75 106,27.75 107.5,26.25 v107.5,21.48
  Bottom 0.254: R70.2 16.75,8 | 16.75,8 16.75,9.79 IC20.3 | IC14.8 4.04,24.54 4,24.5 v5,23.5 | v14.75,8 16.75,8 | v107.5,21.48 107.5,18.25 106.5,17.25 v106.5,3.5
RXEN_3A  (via drill 0.3)
  Top 0.254: v100,39.25 100,34 99,33 96.54,33 S13.15 | v46.75,68.25 50.5,68.25 52.75,70.5 v62.25,70.5 | v102,49.75 v102,56.25
  Bottom 0.254: IC19.2 45.37,57.37 46.5,58.5 46.5,63.25 | 46.5,63.25 47,63.75 47.7,63.75 R78.1 | 46.5,63.25 46.5,65.25 46.25,65.5 46.25,67.75 v46.75,68.25 | v102,56.25 102.25,56.5 102.25,66 97.75,70.5 v62.25,70.5 | v100,39.25 101.25,39.25 101.75,39.75 101.75,48.75 102,49 v102,49.75
RXEN_3B  (via drill 0.3)
  Top 0.254: v106.5,42.25 106.5,33.75 105.75,33 105.73,33.02 S13.6 | v41,51.25 42,51.25 43,52.25 43,54.25 45.75,57 v45.75,59 55.75,59 57.25,60.5 58.75,60.5 59.5,59.75 67.5,59.75 71,56.25 v91.5,56.25 | v98.25,52.5 v98.25,56.25 | v106.5,49.5 v106.5,51.75
  Bottom 0.254: R80.2 44.5,62.25 45.75,61 v45.75,59 45.25,58.5 44.06,58.5 IC19.3 | v98.25,52.5 105.75,52.5 v106.5,51.75 | v41,51.25 41,49.12 IC15.8 | v98.25,56.25 v91.5,56.25 | v106.5,42.25 v106.5,49.5
RXEN_4A  (via drill 0.3)
  Top 0.254: v98,18.5 99,19.5 99,26.5 v98.5,27 | v98.5,35.5 98.5,37.75 98,38.25 96.67,38.25 S13.13 | v95,15 v95,5.5 | v46.25,8.75 51.75,8.75 v54,6.5
  Bottom 0.254: IC22.2 43.88,9.29 44.5,8.67 R87.1 46.17,8.67 v46.25,8.75 | v98,18.5 97.25,17.75 95.5,17.75 95,17.25 v95,15 | v98.5,27 v98.5,35.5 | v95,5.5 95,3.5 93,1.5 66.25,1.5 65.25,2.5 65.25,3.75 64.5,4.5 54.5,4.5 54,5 v54,6.5
RXEN_4B  (via drill 0.3)
  Top 0.254: v85.75,10.5 83.25,10.5 82.75,10 75.75,10 74.5,8.75 64.5,8.75 62.5,10.75 50,10.75 46,14.75 42.25,14.75 v42,15 v37,15 | v93.25,11 93.25,20 v91.75,21.5 | v93.75,23.5 93.75,26 93.5,26.25 93.5,38 v92.75,38.75 | v30,18.75 v30,27.5
  Bottom 0.254: 42.62,9 IC22.3 42.62,12.63 42,13.25 v42,15 | 42.62,9 42.62,8.79 | R89.2 42.29,8.67 42.62,9 | v30,27.5 30.5,28 31.12,28 IC16.8 | v91.75,21.5 92.75,21.5 93.75,22.5 v93.75,23.5 | v92.75,38.75 94.5,38.75 95,39.25 98.5,39.25 99.75,38 104.04,38 S13.8 | v30,18.75 30,15.25 30.75,14.5 35,14.5 35.5,15 v37,15 | v85.75,10.5 92.75,10.5 v93.25,11
RXEN_5A  (via drill 0.3)
  Top 0.254: v64.25,64.5 62.5,66.25 62.5,68.25 64.5,70.25 93.25,70.25 96.25,67.25 v96.25,67 97.5,65.75 99.75,65.75 101.25,64.25 101.25,58 99.5,56.25 v99.5,51.75
  Bottom 0.254: IC23.2 64.89,64.36 64.75,64.5 v64.25,64.5 | R96.1 95.85,66.6 v96.25,67 | S13.11 98.18,43.18 99,44 99,51.25 v99.5,51.75
RXEN_5B  (via drill 0.3)
  Top 0.254: v65.5,50.5 65.5,47.25 66,46.75 72,46.75 72.5,47.25 v72.5,48.75 | v75.75,50.25 75.75,51 76.25,51.5 79.75,51.5 81.25,53 81.25,54 81.5,54.25 v84.5,54.25 | v88,54.25 v92.25,54.25 | v107.75,53.25 v107.75,49.5
  Bottom 0.254: IC23.3 63.75,65.64 63.25,65.14 63.25,64.25 64,63.5 64,56.25 65.44,54.81 IC17.8 65.44,50.56 v65.5,50.5 | v72.5,48.75 74.25,48.75 v75.75,50.25 | R98.2 83.5,54.25 v84.5,54.25 v88,54.25 | 104.21,43.25 S13.10 104.32,43.18 106,41.5 107.25,41.5 107.75,42 v107.75,49.5 | v92.25,54.25 106.75,54.25 v107.75,53.25
RXEN_6A  (via drill 0.3)
  Top 0.254: v59,26 58.5,26.5 v58.5,29.75 | v60.75,33.25 66,33.25 67,34.25 v70.25,34.25 | v85.75,42.5 86,42.75 v89.75,42.75 | v72.75,34.5 v78.5,34.5
  Bottom 0.254: v58.5,29.75 58.5,31.86 R106.1 59.45,31.95 v60.75,33.25 | v85.75,42.5 85.5,42.25 85.5,40.5 85,40 81,40 79.75,38.75 79.75,35 79.25,34.5 v78.5,34.5 | v89.75,42.75 91,42.75 92,43.75 92,49.5 93.25,50.75 96.47,50.75 S14.3 | v70.25,34.25 71,34.25 71.5,34.75 72.5,34.75 v72.75,34.5 | IC24.2 58.62,25.61 v59,26
RXEN_6B  (via drill 0.3)
  Top 0.254: 71.12,19.12 70,18 70,14.5 v69.25,13.75 | v59.5,26.75 65.75,26.75 67,25.5 67,23.25 71.12,19.12 | v87.25,19.5 87.25,31.25 89.25,33.25 91.25,33.25 91.75,33.75 91.75,41.75 v92.25,42.25 | 71.12,19.12 71.88,19.12 72.5,19.75 72.5,21 73,21.5 74.5,21.5 75.5,20.5 75.5,19.75 76,19.25 v78,19.25
  Bottom 0.254: R108.2 86.75,18 85.5,19.25 | 85.5,19.25 v78,19.25 | v69.25,13.75 66.75,13.75 66.25,14.25 66.25,15.74 IC18.8 | IC24.3 59.37,26.89 v59.5,26.75 | 85.5,19.25 87,19.25 v87.25,19.5 | v92.25,42.25 94.75,42.25 95,42 98.5,42 100,43.5 100,49.75 101,50.75 104.09,50.75 S14.2
TERM_1
  Bottom 0.254: R66.1 96.2,20 S13.20
TERM_2
  Bottom 0.254: R75.1 93.42,26.83 94.75,25.5 96.42,25.5 S13.18
TERM_3
  Bottom 0.254: R85.1 95.75,31.25 S13.16
TERM_4
  Bottom 0.254: R94.1 96.46,35.5 S13.14
TERM_5
  Bottom 0.254: R103.1 96.38,40.5 S13.12
TERM_6
  Bottom 0.254: R113.1 95.5,45.5 96.5,46.5 96.5,48.24 S14.4
VCC  (via drill 0.3)
  Bottom 0.254: R73.1 8.41,13.33 R67.2 6,13.23 v6,11.75 | IC20.8 19.16,15 | 19.16,15 19.16,14.65 v18.75,14.25 | C25.1 19.98,14.18 19.16,15 | R68.2 24.75,6.25 v26,7.5 | 95.25,61.94 R96.2 96.04,62.54 v97.5,64 | R101.1 79.59,63.16 v79.5,63.25 | v73.25,62.25 73.19,62.25 IC23.8 70.84,63.09 70.5,62.75 70.5,60.89 70.57,60.82 C15.1 | C32.1 49.42,53.42 50,54 50,56.02 | 50,56.02 IC19.8 | C31.1 IC21.8 | C23.1 32.35,48.93 IC15.14 33.25,48.87 v33.25,47.25 | R10.2 5.14,47.42 IC11.14 | IC22.8 45.33,18 47,18 47.34,17.66 C24.1 48.97,15.53 v49,15.5 | C30.1 13.71,25.29 13,26 v12.5,26 11.73,26 IC14.14 | C16.1 4.58,50.27 IC11.14 | v6.25,47 6.25,48.75 | 6.25,48.75 6,49 | IC11.14 6.29,48.72 6.25,48.75 | 13.95,42.8 R104.2 13,43 v13,45.75 | C31.1 20.23,55.98 v20.75,56.5 | R64.1 25.16,64.41 v25.75,65 | v30.75,16 32.17,16 R86.2 | R87.2 45.58,5.83 v46.5,6.75 | IC16.14 39.33,28.07 C4.1 v41,30 | v44.75,25.75 44.75,24.85 R92.1 | R106.2 54.8,31.95 v54.25,32.5 | C26.1 63.46,24.21 | 63.46,24.21 IC24.8 64.14,23.8 R111.1 | 63.46,24.21 61.79,24.21 v61.75,24.25 | C27.1 75.25,17.12 IC18.14 74.41,15.5 v75,15.5 | R105.2 73.95,4.55 v74,4.5 | v73.25,50 73.06,50.19 IC17.14 75.08,52.07 C28.1 | v36.25,63.75 37.94,63.75 R77.2 | R78.2 48.89,66.64 v49.5,67.25 | 50,56.02 48.48,56.02 v48.25,56.25 | R20.2 16.4,53.15 18.75,55.5 18.75,55.65 C31.1 | R83.1 55.67,61.33 v55.5,61.5 | v62.75,42.75 64.22,42.75 R95.2 | R1.2 121.83,52.58 v122,52.75 | R76.2 5.73,59.48 v6,59.75
  Bottom 0.61: C3.+ 112.1,18.6 v110.75,17.25
  pour Top (rank 2): 0,0 0,72 125,72 125,0
VIN  (via drill 0.3)
  Top 0.61: POWER.5 117.53,60.73 117.5,60.75 113.5,60.75 111.25,58.5 111.25,54.5 v113,52.75
  Bottom 0.61: IC1.3 118.31,45.69 116.59,47.41 C1.1 115.75,50.02 115.75,51.25 114.25,52.75 v113,52.75
VOUT  (via drill 0.3, 0.6)
  Top 0.61: POWER.1 115.5,56.44 115.5,50 v115,49.5
  Bottom 0.61: 115.89,42.98 115.89,45.12 113.43,47.57 C2.1 | IC1.4 IC1.2 115.89,42.98 | 115.89,42.21 115.89,42.98 | C2.1 113.43,50.43 | v115,49.5 113.79,49.5 C2.1
  other vias: 112,36 112,34 112,32 112,30 114,30 116,30 118,30 120,30 120,32 120,34 120,36 116,32 116,34
  pour Bottom: 112,38 120,38 121,37 121,29 111,29 111,37
  pour Top: 120,38 112,38 111,37 111,29 121,29 121,37

### Text on the board
tPlace: RX EN 6 | NORMAL | DIRECT | NORMAL | DIRECT | NORMAL | DIRECT | TERM 6 | FLIP DATA | TO HUB | FLIP DATA | TO HUB | FLIP DATA | TO HUB | RX EN 5 | TERM 5 | RX EN 4 | DMX/RDM Adapter / RS485 Hub | TERM 4 | RX EN 3 | TERM 3 | FLIP DATA | TO HUB | FLIP DATA | TO HUB | FLIP DATA | TO HUB | RX EN 2 | + | - | NORMAL | DIRECT | NORMAL | DIRECT | NORMAL | DIRECT | TERM 2 | Data2 3 | RX EN 1 | Data2 4 | TERM 1 | Data2 5 | Data2 6 | + | - | felitek.de | GND | VCC | DATA
bPlace: BAT+ | 9V | BAT-
tOrigins: Case: Combiplast CP-Z-77/BL
tNames: Port 5 | USB PWR | BATTERY | USB / OFF | Port 1 | Port 3 | Port 2 | Port 4 | Port 6